# EAGLE board nixie_schema (EAGLE 8.2.1), part 1 of 2
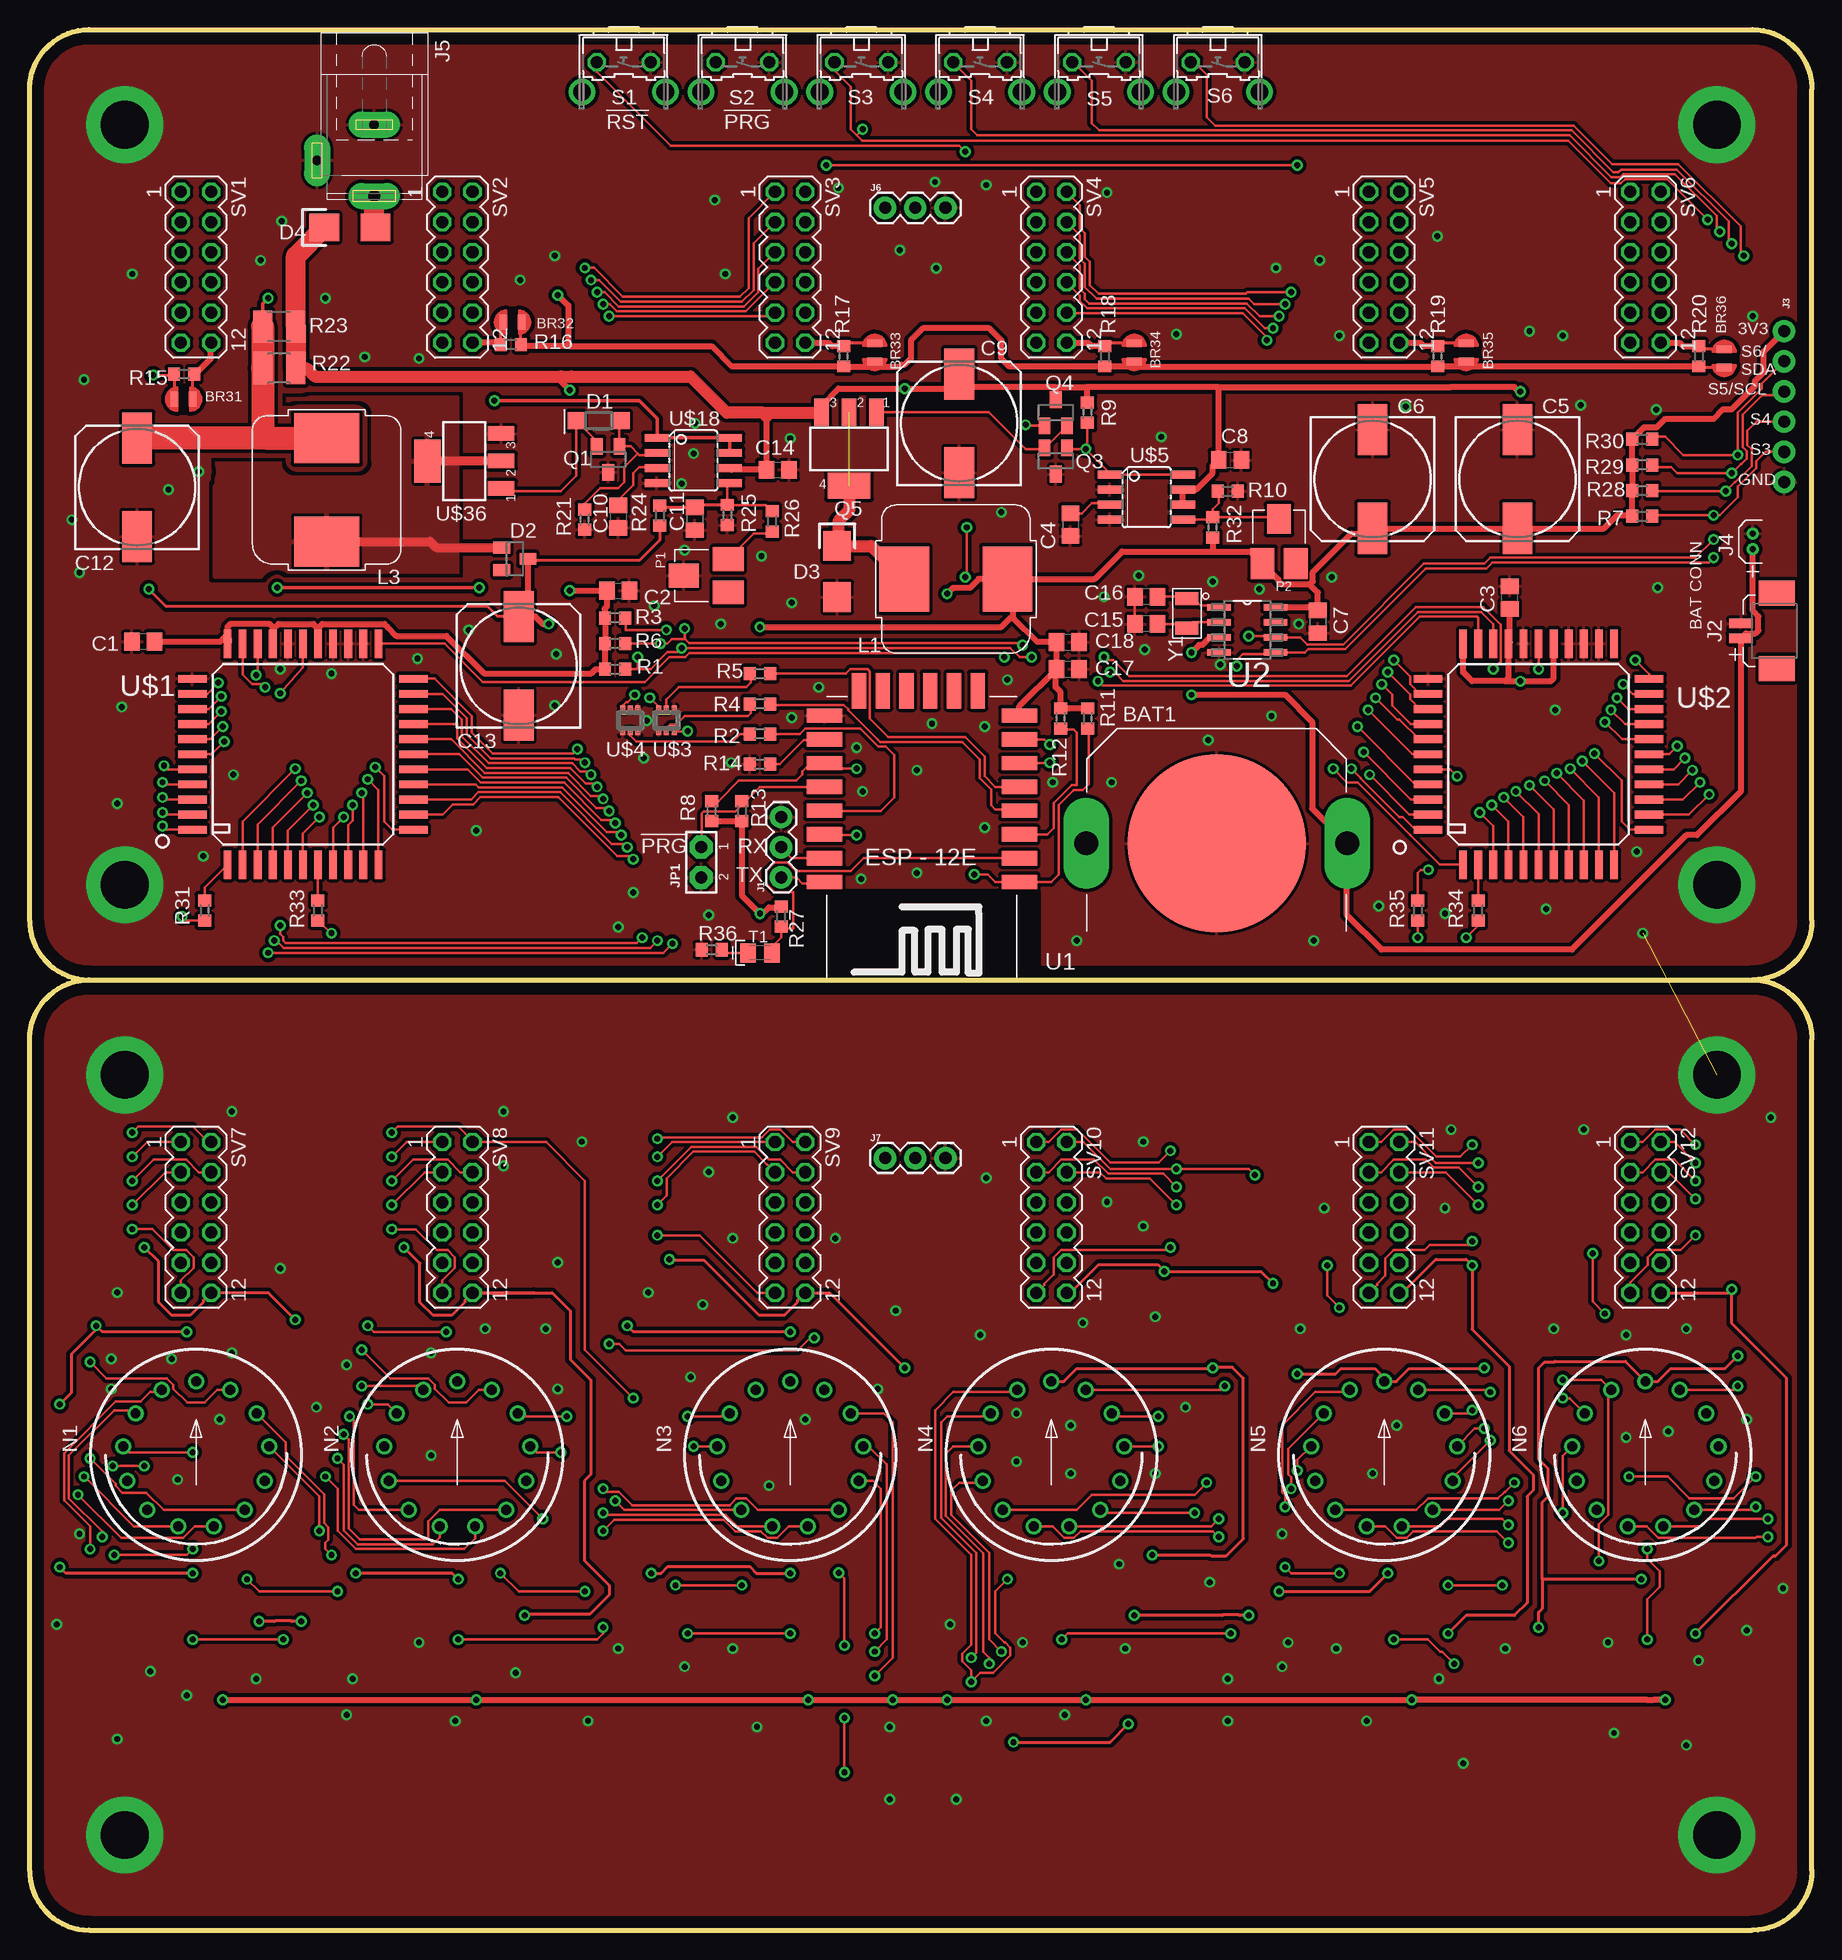
[diagram p6: board, top side]
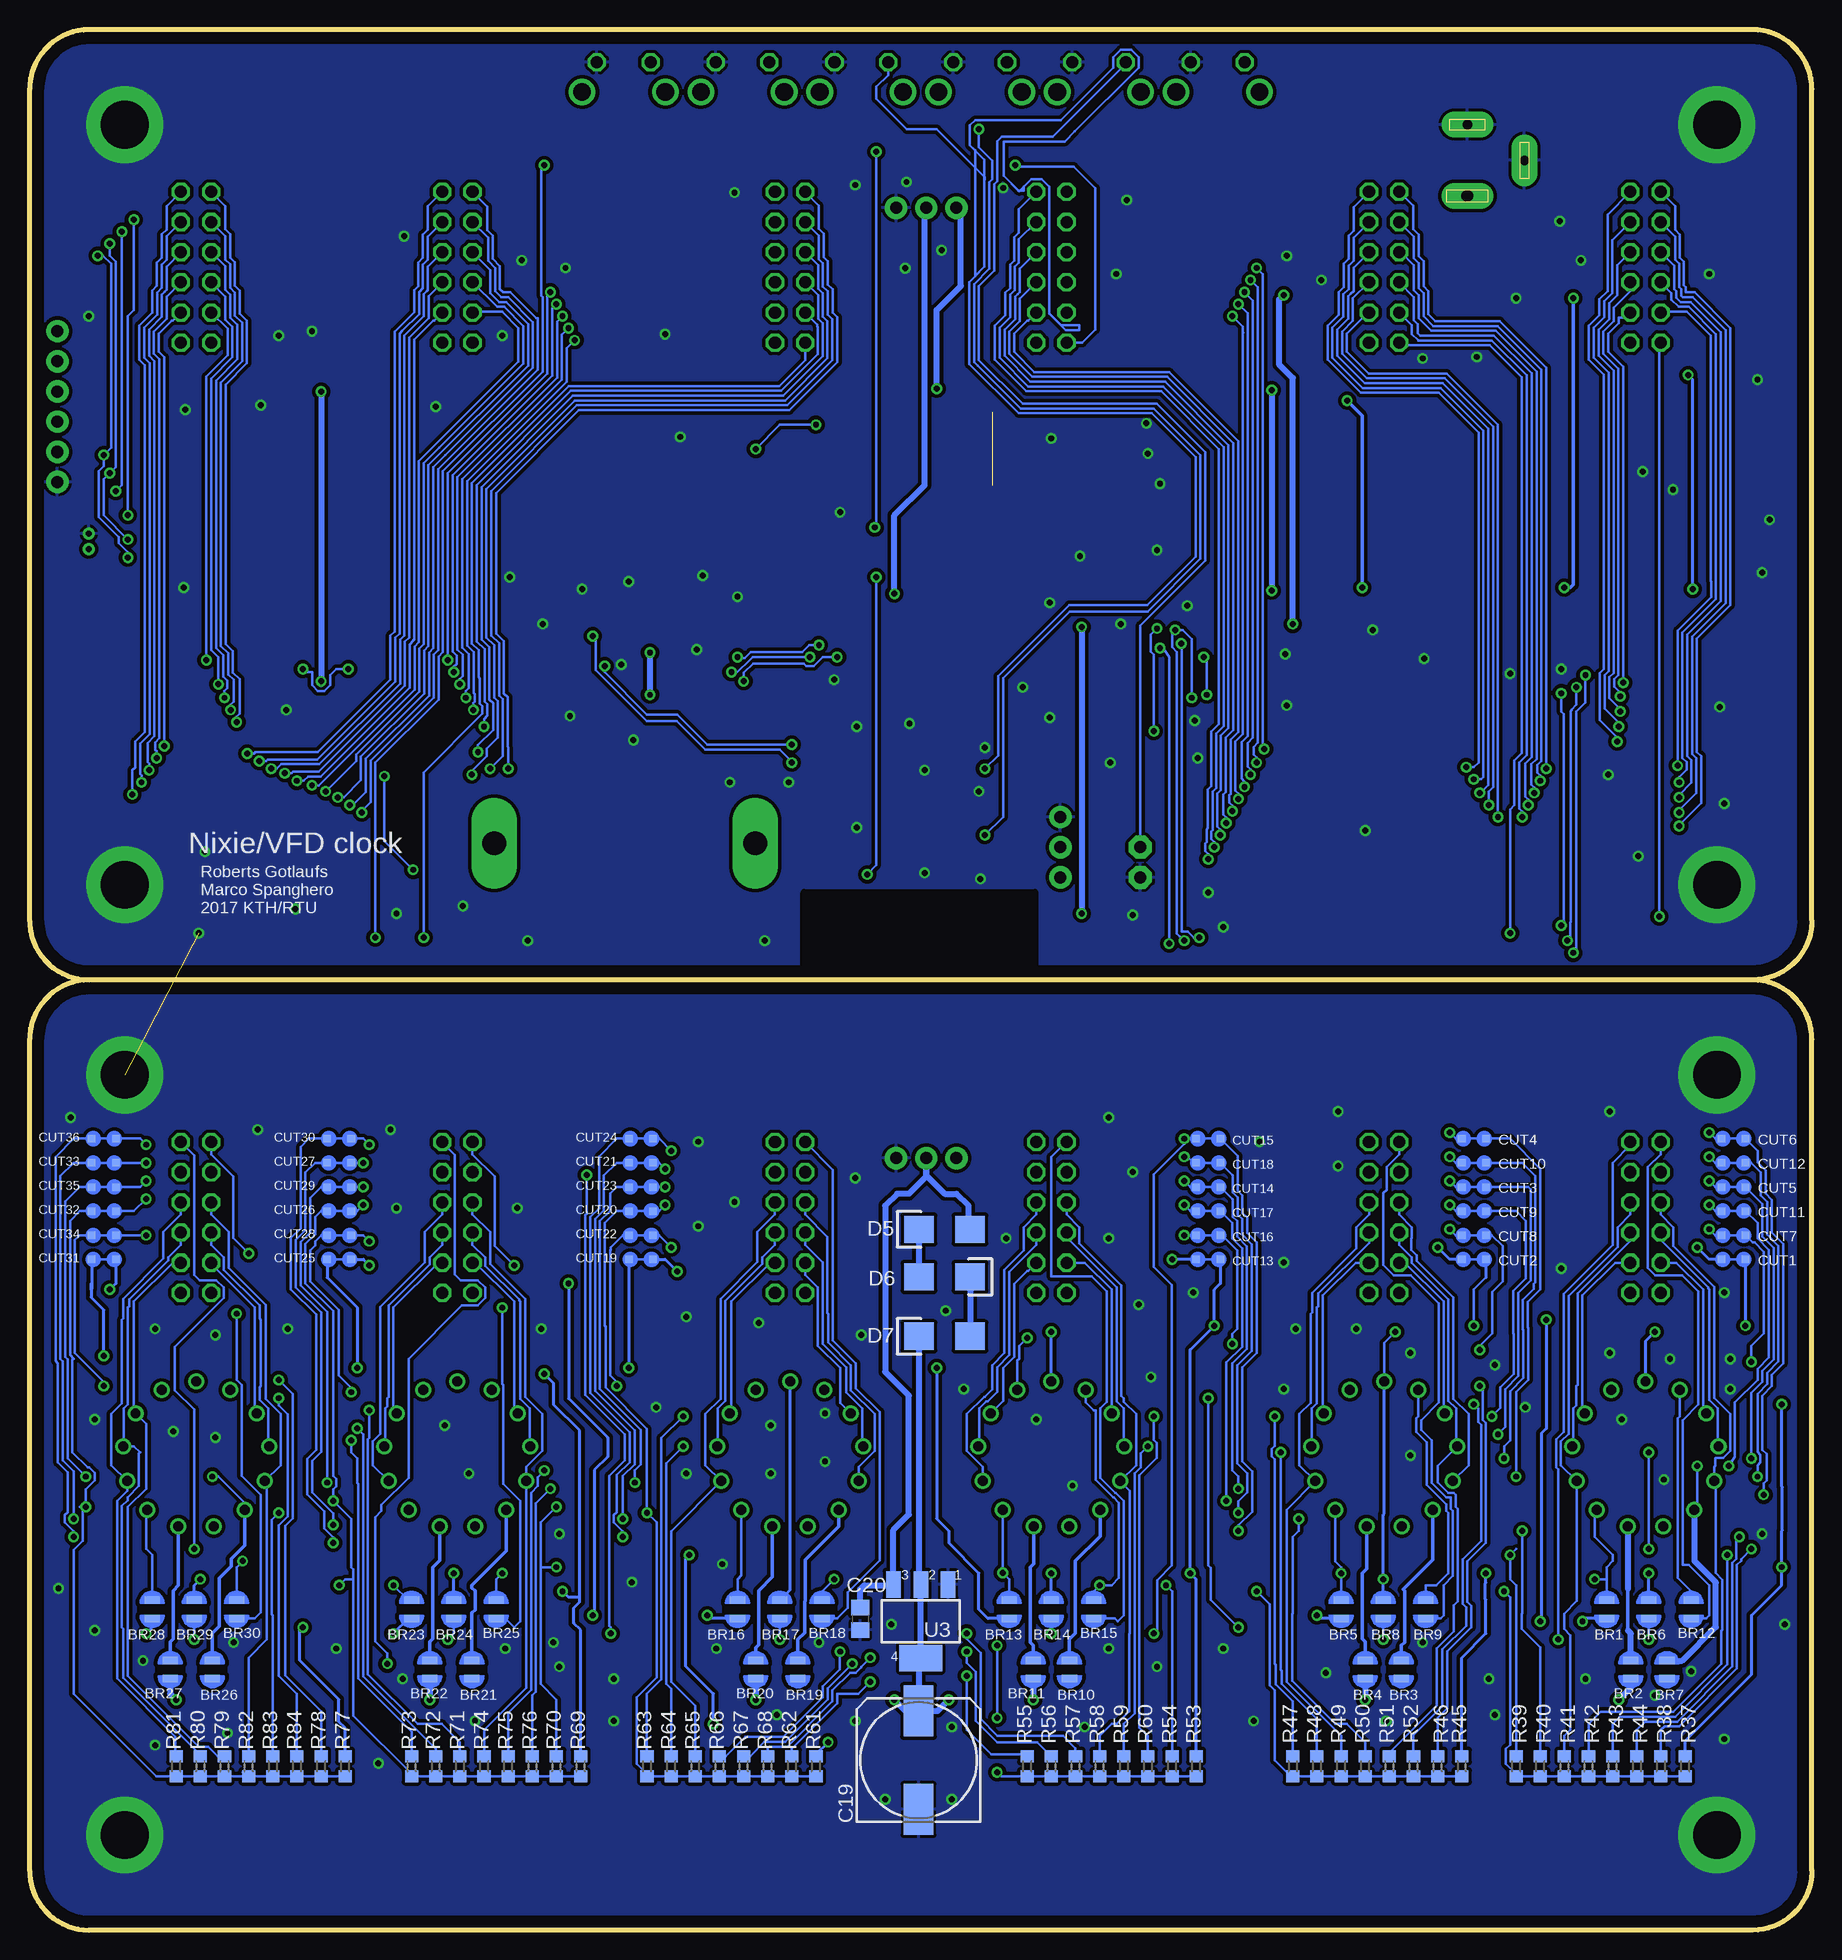
[diagram p7: board, bottom side, seen from below]

Size 150 x 160 mm. Coordinates in mm from the lower left corner, seen from the top.
Outline: 145,80 arc90 150,85 150,155 arc90 145,160 5,160 arc90 0,155 0,85 arc90 5,80
Outline: 5,80 145,80
Outline: 5,80 arc90 0,75 0,5 arc90 5,0 145,0 arc90 150,5 150,75 arc90 145,80
Copper layers (1*16): Top 0.035mm / dielectric 1.5mm / Bottom 0.035mm
Design rules "default *": minimum track width 8mil, minimum drill 16mil, track to track 8mil, track to pad 8mil, pad to pad 8mil, via to via 8mil, smd to smd 8mil, copper to edge 40mil, drill to drill 8mil, minimum pad ring 10mil, minimum via ring 8mil, stop-mask expansion 4mil, vias tented up to drill 0.5mm, thermal gap 10mil
Net classes: 0 default: width 0.203 mm, drill 0.5 mm, clearance 0.203 mm; 1 Power: width 0.508 mm, drill 0.5 mm, clearance 0.203 mm; 2 HV: width 0.254 mm, drill 0.5 mm, clearance 1 mm; 3 medium power: width 0.508 mm, drill 0.5 mm, clearance 0.203 mm; 4 smallish power: width 0.305 mm, drill 0.5 mm, clearance 0.203 mm
tRestrict: area 65.4,80.3 to 84.8,87.4
bRestrict: area 65.4,80.3 to 84.8,87.4

## Footprints (pad centres in the part's own frame; a part is rotated, then mirrored left to right if it is on the bottom)
CR2032 = drill 2 pad 3.81 long: +_1 10.985,0; +_2 -10.985,0 | smd 15 x 15: - 0,0
HV_SOLDER_BRIDGE = smd 1.27 x 0.635: P$1 0,0.762; P$2 0,-0.762
C0805 = smd 1.3 x 1.5: 1 -0.95,0; 2 0.95,0
153CLV-1014 = smd 4.3 x 2.5: + 4.15,0; - -4.15,0
CUT_TRACE_2 = smd 0.635 x 0.635: P$1 0,1.016; P$2 0,-1.016
SOD123 = smd 1.4 x 1.4: A 1.9,0; C -1.9,0
SOT23 = smd 1 x 1.4: 1 -0.95,-1.1; 2 0.95,-1.1; 3 0,1.1
SMA/SMB = smd 2.5 x 2.3: A 2.15,0; C -2.15,0
1X03 = drill 1.016 pad 1.88: 1 0,0; 2 2.54,0; 3 5.08,0
PICOBLADE_SMD_2 = smd 0.8 x 2: + -0.625,3; - 0.625,3 | smd 2.1 x 3: CHAS_1 -3.175,0; CHAS_2 3.175,0
1X06_NO_SILK = drill 1.016 pad 1.88: 1 0,0; 2 2.54,0; 3 5.08,0; 4 7.62,0; 5 10.16,0; 6 12.7,0
PICOBLADE_THT_2 = drill 0.5: + -0.625,0; - 0.675,0
SPC4077 = drill 0.8 pad 2.184 long: 1 -3,0; 2 0,-4.8 | drill 1 pad 2.184 long: 3 3,0
JUMPER2 = drill 1 pad 1.93 octagon: 1 2.54,0; 2 0,0
INDUCTOR_PACKAGE = smd 5.5 x 4.2: P$1 0,4.35; P$2 0,-4.35
IN-14_IV-11 = drill 0.84: 0(B) 5.094,3.516; 1(F) -5.094,3.516; 2(E) -6.145,0.746; 3(D) -5.788,-2.195; 4(CAT) -4.105,-4.633; 5(NC) -1.481,-6.01; 6(CAT) 1.481,-6.01; 7(GRID) 4.105,-4.633; 8(C) 5.788,-2.195; 9(DP) 6.145,0.746; A(A) 0,6.19; LHDP(G) -2.877,5.481; RHDP(NC) 2.877,5.481
UNI_POT_SMD = smd 2 x 2.6: P$1 -1.4,-1.9; P$3 1.4,-1.9 | smd 2 x 2.5: P$2 0,1.85
SOT223 = smd 1.219 x 2.235: 1 -2.311,-3.099; 2 0,-3.099; 3 2.311,-3.099 | smd 3.6 x 2.2: 4 0,3.099
R0603 = smd 1 x 1.1: 1 -0.85,0; 2 0.85,0
R1210 = smd 1.6 x 2.7: 1 -1.4,0; 2 1.4,0
B3F-31XX = drill 1.016 octagon: 1 -2.261,-1.245; 2 2.261,-1.245 | drill 1.499 pad 2.159: 3 -3.505,1.245; 4 3.505,1.245
MA06-2 = drill 1.016 octagon: 1 -6.35,-1.27; 2 -6.35,1.27; 3 -3.81,-1.27; 4 -3.81,1.27; 5 -1.27,-1.27; 6 -1.27,1.27; 7 1.27,-1.27; 8 1.27,1.27; 9 3.81,-1.27; 10 3.81,1.27; 11 6.35,-1.27; 12 6.35,1.27
C0805K = smd 1.3 x 1.6: COL 1,0; EMI -1,0
ESP12E-SMD = smd 3 x 1.2: ADC -8.3,3.8; CH_PD -8.3,1.8; GND 8.1,-8.2; GPIO0 8.1,-2.2; GPIO2 8.1,-4.2; GPIO4 8.1,-0.2; GPIO5 8.1,1.8; GPIO12 -8.3,-4.2; GPIO13 -8.3,-6.2; GPIO14 -8.3,-2.2; GPIO15 8.1,-6.2; GPIO16 -8.3,-0.2; RESET -8.3,5.8; RXD0 8.1,3.8; TXD0 8.1,5.8; VCC -8.3,-8.2 | smd 1.2 x 3: CS0 -4.8,-10.3; GPIO9 -0.8,-10.3; GPIO10 1.2,-10.3; MISO -2.8,-10.3; MOSI 3.2,-10.3; SCLK 5.2,-10.3
SOIC8-N_MC = smd 1.981 x 0.559: 1 -2.362,1.905; 2 -2.362,0.635; 3 -2.362,-0.635; 4 -2.362,-1.905; 5 2.362,-1.905; 6 2.362,-0.635; 7 2.362,0.635; 8 2.362,1.905
CQFP-44 = smd 0.65 x 2.4: 1 -6.35,-9.3; 2 -5.08,-9.3; 3 -3.81,-9.3; 4 -2.54,-9.3; 5 -1.27,-9.3; 6 0,-9.3; 7 1.27,-9.3; 8 2.54,-9.3; 9 3.81,-9.3; 10 5.08,-9.3; 11 6.35,-9.3; 23 6.35,9.3; 24 5.08,9.3; 25 3.81,9.3; 26 2.54,9.3; 27 1.27,9.3; 28 0,9.3; 29 -1.27,9.3; 30 -2.54,9.3; 31 -3.81,9.3; 32 -5.08,9.3; 33 -6.35,9.3 | smd 2.4 x 0.65: 12 9.3,-6.35; 13 9.3,-5.08; 14 9.3,-3.81; 15 9.3,-2.54; 16 9.3,-1.27; 17 9.3,0; 18 9.3,1.27; 19 9.3,2.54; 20 9.3,3.81; 21 9.3,5.08; 22 9.3,6.35; 34 -9.3,6.35; 35 -9.3,5.08; 36 -9.3,3.81; 37 -9.3,2.54; 38 -9.3,1.27; 39 -9.3,0; 40 -9.3,-1.27; 41 -9.3,-2.54; 42 -9.3,-3.81; 43 -9.3,-5.08; 44 -9.3,-6.35
SOT-363 = smd 0.42 x 0.6: 1 -0.65,-0.95; 2 0,-0.95; 3 0.65,-0.95; 4 0.65,0.95; 5 0,0.95; 6 -0.65,0.95
SOIC08 = smd 0.66 x 2.032: 1 -1.905,-3.073; 2 -0.635,-3.073; 3 0.635,-3.073; 4 1.905,-3.073; 5 1.905,3.073; 6 0.635,3.073; 7 -0.635,3.073; 8 -1.905,3.073
CRYSTAL_PACK = smd 1.1 x 1.9: P$1 -1.25,0; P$2 1.25,0

## Placement (x,y rotation side)
BAT1  CR2032  [CR2032]  99.91,91.5 0 top
BR1  HV_SOLDER_BRIDGE  [HV_SOLDER_BRIDGE]  17.27,27.01 0 bottom
BR2  HV_SOLDER_BRIDGE  [HV_SOLDER_BRIDGE]  15.24,21.93 180 bottom
BR3  HV_SOLDER_BRIDGE  [HV_SOLDER_BRIDGE]  34.54,21.93 0 bottom
BR4  HV_SOLDER_BRIDGE  [HV_SOLDER_BRIDGE]  37.59,21.93 180 bottom
BR5  HV_SOLDER_BRIDGE  [HV_SOLDER_BRIDGE]  39.62,27.01 0 bottom
BR6  HV_SOLDER_BRIDGE  [HV_SOLDER_BRIDGE]  13.72,27.01 0 bottom
BR7  HV_SOLDER_BRIDGE  [HV_SOLDER_BRIDGE]  12.19,21.93 0 bottom
BR8  HV_SOLDER_BRIDGE  [HV_SOLDER_BRIDGE]  36.07,27.01 0 bottom
BR9  HV_SOLDER_BRIDGE  [HV_SOLDER_BRIDGE]  32.51,27.01 180 bottom
BR10  HV_SOLDER_BRIDGE  [HV_SOLDER_BRIDGE]  62.48,21.93 0 bottom
BR11  HV_SOLDER_BRIDGE  [HV_SOLDER_BRIDGE]  65.53,21.93 180 bottom
BR12  HV_SOLDER_BRIDGE  [HV_SOLDER_BRIDGE]  10.16,27.01 180 bottom
BR13  HV_SOLDER_BRIDGE  [HV_SOLDER_BRIDGE]  67.56,27.01 0 bottom
BR14  HV_SOLDER_BRIDGE  [HV_SOLDER_BRIDGE]  64.01,27.01 0 bottom
BR15  HV_SOLDER_BRIDGE  [HV_SOLDER_BRIDGE]  60.45,27.01 180 bottom
BR16  HV_SOLDER_BRIDGE  [HV_SOLDER_BRIDGE]  90.42,27.01 0 bottom
BR17  HV_SOLDER_BRIDGE  [HV_SOLDER_BRIDGE]  86.87,27.01 0 bottom
BR18  HV_SOLDER_BRIDGE  [HV_SOLDER_BRIDGE]  83.31,27.01 180 bottom
BR19  HV_SOLDER_BRIDGE  [HV_SOLDER_BRIDGE]  85.34,21.93 0 bottom
BR20  HV_SOLDER_BRIDGE  [HV_SOLDER_BRIDGE]  88.9,21.93 180 bottom
BR21  HV_SOLDER_BRIDGE  [HV_SOLDER_BRIDGE]  112.78,21.93 0 bottom
BR22  HV_SOLDER_BRIDGE  [HV_SOLDER_BRIDGE]  116.33,21.93 180 bottom
BR23  HV_SOLDER_BRIDGE  [HV_SOLDER_BRIDGE]  117.86,27.01 0 bottom
BR24  HV_SOLDER_BRIDGE  [HV_SOLDER_BRIDGE]  114.3,27.01 0 bottom
BR25  HV_SOLDER_BRIDGE  [HV_SOLDER_BRIDGE]  110.74,27.01 180 bottom
BR26  HV_SOLDER_BRIDGE  [HV_SOLDER_BRIDGE]  134.62,21.93 0 bottom
BR27  HV_SOLDER_BRIDGE  [HV_SOLDER_BRIDGE]  138.18,21.93 180 bottom
BR28  HV_SOLDER_BRIDGE  [HV_SOLDER_BRIDGE]  139.7,27.01 0 bottom
BR29  HV_SOLDER_BRIDGE  [HV_SOLDER_BRIDGE]  136.14,27.01 0 bottom
BR30  HV_SOLDER_BRIDGE  [HV_SOLDER_BRIDGE]  132.59,27.01 180 bottom
BR31  HV_SOLDER_BRIDGE  [HV_SOLDER_BRIDGE]  12.95,128.9 270 top
BR32  HV_SOLDER_BRIDGE  [HV_SOLDER_BRIDGE]  40.64,135.37 90 top
BR33  HV_SOLDER_BRIDGE  [HV_SOLDER_BRIDGE]  71.12,132.83 0 top
BR34  HV_SOLDER_BRIDGE  [HV_SOLDER_BRIDGE]  92.96,132.83 0 top
BR35  HV_SOLDER_BRIDGE  [HV_SOLDER_BRIDGE]  120.9,132.83 0 top
BR36  HV_SOLDER_BRIDGE  [HV_SOLDER_BRIDGE]  142.62,132.32 0 top
C1  100n  [C0805]  9.54,108.47 180 top
C2  100n  [C0805]  49.53,112.77 0 top
C3  100n  [C0805]  124.58,112.2 90 top
C4  270p  [C0805]  87.6,118.32 270 top
C5  100u  [153CLV-1014]  125.22,122.16 270 top
C6  100u  [153CLV-1014]  113.03,122.16 270 top
C7  100n  [C0805]  108.42,110.15 270 top
C8  100n  [C0805]  101.03,123.78 0 top
C9  220u  [153CLV-1014]  78.23,126.86 90 top
C10  680p  [C0805]  49.54,119.02 270 top
C11  10n  [C0805]  55.98,118.82 270 top
C12  220u  [153CLV-1014]  9.04,121.48 90 top
C13  2.2u  [153CLV-1014]  41.16,106.44 90 top
C14  100n  [C0805]  62.96,122.94 0 top
C15  6p  [C0805]  93.98,109.97 180 top
C16  6p  [C0805]  93.98,112.26 180 top
C17  100n  [C0805]  87.38,106.16 0 top
C18  100n  [C0805]  87.38,108.45 0 top
C19  10u  [153CLV-1014]  75.18,14.31 90 bottom
C20  100n  [C0805]  80.1,26.22 270 bottom
CUT1  CUT_TRACE  [CUT_TRACE_2]  6.6,56.47 270 bottom
CUT2  CUT_TRACE  [CUT_TRACE_2]  28.45,56.47 270 bottom
CUT3  CUT_TRACE  [CUT_TRACE_2]  28.45,62.57 270 bottom
CUT4  CUT_TRACE  [CUT_TRACE_2]  28.45,66.63 270 bottom
CUT5  CUT_TRACE  [CUT_TRACE_2]  6.6,62.57 270 bottom
CUT6  CUT_TRACE  [CUT_TRACE_2]  6.6,66.63 270 bottom
CUT7  CUT_TRACE  [CUT_TRACE_2]  6.6,58.5 90 bottom
CUT8  CUT_TRACE  [CUT_TRACE_2]  28.45,58.5 90 bottom
CUT9  CUT_TRACE  [CUT_TRACE_2]  28.45,60.54 90 bottom
CUT10  CUT_TRACE  [CUT_TRACE_2]  28.45,64.6 90 bottom
CUT11  CUT_TRACE  [CUT_TRACE_2]  6.6,60.54 90 bottom
CUT12  CUT_TRACE  [CUT_TRACE_2]  6.6,64.6 90 bottom
CUT13  CUT_TRACE  [CUT_TRACE_2]  50.8,56.47 270 bottom
CUT14  CUT_TRACE  [CUT_TRACE_2]  50.8,62.57 270 bottom
CUT15  CUT_TRACE  [CUT_TRACE_2]  50.8,66.63 270 bottom
CUT16  CUT_TRACE  [CUT_TRACE_2]  50.8,58.5 90 bottom
CUT17  CUT_TRACE  [CUT_TRACE_2]  50.8,60.54 90 bottom
CUT18  CUT_TRACE  [CUT_TRACE_2]  50.8,64.6 90 bottom
CUT19  CUT_TRACE  [CUT_TRACE_2]  98.55,56.47 90 bottom
CUT20  CUT_TRACE  [CUT_TRACE_2]  98.55,60.54 90 bottom
CUT21  CUT_TRACE  [CUT_TRACE_2]  98.55,64.6 90 bottom
CUT22  CUT_TRACE  [CUT_TRACE_2]  98.55,58.5 270 bottom
CUT23  CUT_TRACE  [CUT_TRACE_2]  98.55,62.57 270 bottom
CUT24  CUT_TRACE  [CUT_TRACE_2]  98.55,66.63 270 bottom
CUT25  CUT_TRACE  [CUT_TRACE_2]  123.95,56.47 90 bottom
CUT26  CUT_TRACE  [CUT_TRACE_2]  123.95,60.54 90 bottom
CUT27  CUT_TRACE  [CUT_TRACE_2]  123.95,64.6 90 bottom
CUT28  CUT_TRACE  [CUT_TRACE_2]  123.95,58.5 270 bottom
CUT29  CUT_TRACE  [CUT_TRACE_2]  123.95,62.57 270 bottom
CUT30  CUT_TRACE  [CUT_TRACE_2]  123.95,66.63 270 bottom
CUT31  CUT_TRACE  [CUT_TRACE_2]  143.76,56.47 90 bottom
CUT32  CUT_TRACE  [CUT_TRACE_2]  143.76,60.54 90 bottom
CUT33  CUT_TRACE  [CUT_TRACE_2]  143.76,64.6 90 bottom
CUT34  CUT_TRACE  [CUT_TRACE_2]  143.76,58.5 270 bottom
CUT35  CUT_TRACE  [CUT_TRACE_2]  143.76,62.57 270 bottom
CUT36  CUT_TRACE  [CUT_TRACE_2]  143.76,66.63 270 bottom
D1  1n4148  [SOD123]  47.9,127.09 0 top
D2  BAS21  [SOT23]  40.83,115.45 270 top
D3  B230A-13-F  [SMA/SMB]  67.96,114.38 270 top
D4  B230A-13-F  [SMA/SMB]  26.95,143.35 0 top
D5  [SMA/SMB]  73,59 0 bottom
D6  [SMA/SMB]  73,55 180 bottom
D7  [SMA/SMB]  73,50 0 bottom
J1  [1X03]  63.25,88.64 90 top
J2  RTC_CONSMD  [PICOBLADE_SMD_2]  147.05,109.39 90 top
J3  [1X06_NO_SILK]  147.67,134.62 270 top
J4  RTC_CONTHT  [PICOBLADE_THT_2]  145.04,116.89 90 top
J5  [SPC4077]  29,149 270 top
J6  [1X03]  72,145 0 top
J7  [1X03]  72,65 0 top
JP1  [JUMPER2]  56.52,88.64 90 top
L1  100u  [INDUCTOR_PACKAGE]  77.95,113.75 90 top
L3  150u  [INDUCTOR_PACKAGE]  25,121.26 0 top
N1  IN-14_IV-11_COMBI  [IN-14_IV-11]  14,40 0 top
N2  IN-14_IV-11_COMBI  [IN-14_IV-11]  36,40 0 top
N3  IN-14_IV-11_COMBI  [IN-14_IV-11]  64,40 0 top
N4  IN-14_IV-11_COMBI  [IN-14_IV-11]  86,40 0 top
N5  IN-14_IV-11_COMBI  [IN-14_IV-11]  114,40 0 top
N6  IN-14_IV-11_COMBI  [IN-14_IV-11]  136,40 0 top
P1  100k  [UNI_POT_SMD]  56.9,114.04 90 top
P2  100k  [UNI_POT_SMD]  105.16,116.96 0 top
Q1  BC856B  [SOT23]  48.69,123.83 180 top
Q3  BC856B  [SOT23]  86.36,123.69 180 top
Q4  BCX70H  [SOT23]  86.36,127.75 0 top
Q5  NTF5P03  [SOT223]  68.96,124.7 180 top
R1  2.2k  [R0603]  49.28,106.16 0 top
R2  2.2k  [R0603]  61.47,100.7 180 top
R3  2.2k  [R0603]  49.28,110.48 0 top
R4  2.2k  [R0603]  61.47,103.24 180 top
R5  2.2k  [R0603]  61.47,105.78 180 top
R6  2.2k  [R0603]  49.28,108.32 0 top
R7  2.2K  [R0603]  135.72,119.04 180 top
R8  10k  [R0603]  57.4,94.22 90 top
R9  1k  [R0603]  89.03,127.75 270 top
R10  3.3k  [R0603]  100.84,121.15 0 top
R11  10k  [R0603]  89.05,102.01 90 top
R12  10k  [R0603]  86.77,102.01 90 top
R13  10k  [R0603]  59.94,94.22 90 top
R14  10k  [R0603]  61.47,98.16 0 top
R15  10k  [R0603]  13,131 180 top
R16  10k  [R0603]  40.5,133.5 0 top
R17  10k  [R0603]  68.5,132.5 270 top
R18  10k  [R0603]  90.5,132.5 270 top
R19  10k  [R0603]  118.5,132.5 270 top
R20  10k  [R0603]  140.5,132.5 270 top
R21  1k  [R0603]  46.71,118.75 270 top
R22  0.5R  [R1210]  21,131.5 180 top
R23  0.5R  [R1210]  21,135 180 top
R24  330k  [R0603]  53.05,119.09 90 top
R25  3.3k  [R0603]  58.71,119.14 270 top
R26  5.6k  [R0603]  62.48,118.61 270 top
R27  [R0603]  63.25,85.33 270 top
R28  2.2K  [R0603]  135.72,121.19 180 top
R29  2.2K  [R0603]  135.72,123.35 180 top
R30  2.2K  [R0603]  135.72,125.51 180 top
R31  68k  [R0603]  14.73,85.84 90 top
R32  5.6k  [R0603]  99.57,118.1 90 top
R33  68k  [R0603]  24.26,85.84 90 top
R34  68k  [R0603]  121.92,85.84 90 top
R35  68k  [R0603]  116.84,85.84 90 top
R36  [R0603]  57.4,82.54 180 top
R37  8.2k  [R0603]  10.67,13.8 270 bottom
R38  8.2k  [R0603]  12.7,13.8 270 bottom
R39  8.2k  [R0603]  24.89,13.8 270 bottom
R40  8.2k  [R0603]  22.86,13.8 270 bottom
R41  8.2k  [R0603]  20.83,13.8 270 bottom
R42  8.2k  [R0603]  18.8,13.8 270 bottom
R43  8.2k  [R0603]  16.76,13.8 270 bottom
R44  8.2k  [R0603]  14.73,13.8 270 bottom
R45  8.2k  [R0603]  29.46,13.8 270 bottom
R46  8.2k  [R0603]  31.5,13.8 270 bottom
R47  8.2k  [R0603]  43.69,13.8 270 bottom
R48  8.2k  [R0603]  41.66,13.8 270 bottom
R49  8.2k  [R0603]  39.62,13.8 270 bottom
R50  8.2k  [R0603]  37.59,13.8 270 bottom
R51  8.2k  [R0603]  35.56,13.8 270 bottom
R52  8.2k  [R0603]  33.53,13.8 270 bottom
R53  8.2k  [R0603]  51.82,13.8 270 bottom
R54  8.2k  [R0603]  53.85,13.8 270 bottom
R55  8.2k  [R0603]  66.04,13.8 270 bottom
R56  8.2k  [R0603]  64.01,13.8 270 bottom
R57  8.2k  [R0603]  61.98,13.8 270 bottom
R58  8.2k  [R0603]  59.94,13.8 270 bottom
R59  8.2k  [R0603]  57.91,13.8 270 bottom
R60  8.2k  [R0603]  55.88,13.8 270 bottom
R61  8.2k  [R0603]  83.82,13.8 270 bottom
R62  8.2k  [R0603]  85.85,13.8 270 bottom
R63  8.2k  [R0603]  98.04,13.8 270 bottom
R64  8.2k  [R0603]  96.01,13.8 270 bottom
R65  8.2k  [R0603]  93.98,13.8 270 bottom
R66  8.2k  [R0603]  91.95,13.8 270 bottom
R67  8.2k  [R0603]  89.92,13.8 270 bottom
R68  8.2k  [R0603]  87.88,13.8 270 bottom
R69  8.2k  [R0603]  103.63,13.8 270 bottom
R70  8.2k  [R0603]  105.66,13.8 270 bottom
R71  8.2k  [R0603]  113.79,13.8 270 bottom
R72  8.2k  [R0603]  115.82,13.8 270 bottom
R73  8.2k  [R0603]  117.86,13.8 270 bottom
R74  8.2k  [R0603]  111.76,13.8 270 bottom
R75  8.2k  [R0603]  109.73,13.8 270 bottom
R76  8.2k  [R0603]  107.7,13.8 270 bottom
R77  8.2k  [R0603]  123.44,13.8 270 bottom
R78  8.2k  [R0603]  125.48,13.8 270 bottom
R79  8.2k  [R0603]  133.6,13.8 270 bottom
R80  8.2k  [R0603]  135.64,13.8 270 bottom
R81  8.2k  [R0603]  137.67,13.8 270 bottom
R82  8.2k  [R0603]  131.57,13.8 270 bottom
R83  8.2k  [R0603]  129.54,13.8 270 bottom
R84  8.2k  [R0603]  127.51,13.8 270 bottom
S1  [B3F-31XX]  50,156 180 top
S2  [B3F-31XX]  60,156 180 top
S3  [B3F-31XX]  70,156 180 top
S4  [B3F-31XX]  80,156 180 top
S5  [B3F-31XX]  90,156 180 top
S6  [B3F-31XX]  100,156 180 top
SV1  [MA06-2]  14,140 270 top
SV2  [MA06-2]  36,140 270 top
SV3  [MA06-2]  64,140 270 top
SV4  [MA06-2]  86,140 270 top
SV5  [MA06-2]  114,140 270 top
SV6  [MA06-2]  136,140 270 top
SV7  [MA06-2]  14,60 270 top
SV8  [MA06-2]  36,60 270 top
SV9  [MA06-2]  64,60 270 top
SV10  [MA06-2]  86,60 270 top
SV11  [MA06-2]  114,60 270 top
SV12  [MA06-2]  136,60 270 top
T1  [C0805K]  61.47,82.29 0 top
U1  [ESP12E-SMD]  75,94.05 180 top
U2  MC7940N  [SOIC8-N_MC]  102.48,109.47 0 top
U3  1V5  [SOT223]  75,26 180 bottom
U$1  HV5522  [CQFP-44]  23,99 0 top
U$2  HV5522  [CQFP-44]  127,99 0 top
U$3  BSS138DW  [SOT-363]  53.59,101.84 0 top
U$4  BSS138DW  [SOT-363]  50.55,101.84 0 top
U$5  MC34063  [SOIC08]  93.99,120.65 270 top
U$18  MC34063  [SOIC08]  55.85,123.73 270 top
U$36  IPN60R3K4CE_NMOS  [SOT223]  36.58,123.69 90 top
Y1  [CRYSTAL_PACK]  97.39,110.86 90 top

## Tracks (layer width: path | path; a pad name or v marks a point on that pad's centre or on a via)
1_0_B  (via drill 0.5)
  Top 0.203: N1.0(B) 21.55,41.06 21.55,39.92 24.79,36.67 24.79,34.28 25.14,33.93 25.14,32.85 24.89,32.6 24.89,32.09 v25.4,31.58
  Bottom 0.203: SV7.10 16.54,56.19 19.3,53.42 19.3,43.73 N1.0(B) | R39.1 24.89,29.04 25.4,29.55 v25.4,31.58 24.89,32.09
1_1_F  (via drill 0.5)
  Top 0.203: v6.1,33.1 6.1,33.56 3.31,36.35 3.31,39.97 7.11,43.77 8.65,43.77 N1.1(F)
  Bottom 0.203: SV7.9 11.4,56.19 9.14,53.93 9.14,43.76 N1.1(F) | R44.1 14.73,16.85 14.02,17.56 11.35,17.56 6.71,22.2 6.71,30.91 6.35,31.27 6.35,32.85 v6.1,33.1
1_2_E  (via drill 0.5)
  Top 0.203: v7.11,31.58 13.04,31.58 13.07,31.61 13.24,31.61 v13.72,32.09 | v13.72,40.22 8.38,40.22 N1.2(E)
  Bottom 0.203: SV7.7 12.73,58.09 8.74,54.1 8.74,54.03 8.64,53.93 8.64,44.63 7.93,43.92 7.93,40.82 N1.2(E) | R43.1 16.76,17.36 16.15,17.97 11.52,17.97 7.11,22.37 v7.11,31.58 | v13.72,32.09 v13.72,40.22
1_3_D
  Bottom 0.203: SV7.5 12.73,60.24 11.66,59.17 11.66,57.6 8.23,54.17 8.23,44.8 6.88,43.45 6.88,40.34 7.45,39.77 8.07,39.77 8.13,39.71 8.13,39.09 8.21,39.01 N1.3(D) 8.1,37.69 8.1,30.08 7.52,29.5 7.52,25.3 7.62,25.2 7.62,22.44 11.68,18.37 17.78,18.37 18.8,17.36 R42.1
1_4_CAT  (via drill 0.5)
  Top 0.203: v6.99,39.07 v9.65,39.07
  Bottom 0.203: CUT11.P$2 4.57,59.52 4.57,58.22 3.63,57.28 3.63,48.22 4.57,47.27 4.57,46.31 6.47,44.41 6.47,39.84 v6.99,39.07 | v9.65,39.07 9.65,35.48 N1.4(CAT)
  Bottom 0.508: N1.4(CAT) 9.89,31.09 8.08,29.27 8.08,25.53 10.92,22.69 BR7.P$1
1_5_NC  (via drill 0.5)
  Top 0.203: N1.5(NC) 8.77,33.99 v4.57,38.18
  Bottom 0.203: v4.57,38.18 4.57,39.14 4.32,39.39 4.32,40.02 4.57,40.27 4.57,45.16 3.76,45.98 3.76,46.94 2.81,47.88 2.81,57.61 3.76,58.56 3.76,61.31 4.29,61.84 4.29,63.8 5.08,64.6 CUT12.P$2
1_6_CAT  (via drill 0.5)
  Top 0.203: N1.6(CAT) 13.9,33.99 12.92,33.01 7.71,33.01 v4.06,36.66
  Bottom 0.203: v4.06,36.66 4.06,37.62 3.81,37.87 3.81,40.09 4.17,40.44 4.17,44.99 3.35,45.81 3.35,46.77 2.41,47.71 2.41,57.78 3.35,58.73 3.35,61.48 3.88,62.01 3.88,63.97 4.54,64.63 4.54,65.58 CUT6.P$1
  Bottom 0.279: 15.48,28.77 15.48,28.57 15.49,28.56 15.49,25.23
  Bottom 0.508: N1.6(CAT) 15.48,28.77 15.46,28.75 | BR2.P$2 15.24,24.98 15.49,25.23
1_7_GRID  (via drill 0.5)
  Top 0.203: v5.08,39.71 7.23,37.55 7.23,37.4 7.81,36.83 9.82,36.83 11.28,35.37 N1.7(GRID) | v25.91,28.53 19.3,28.53 v18.29,29.55
  Bottom 0.203: v5.08,39.71 5.08,45.23 4.17,46.14 4.17,47.1 3.22,48.05 3.22,57.45 4.17,58.39 4.17,61.15 CUT5.P$1 | N1.7(GRID) 18.29,35.18 18.29,33.1 16.76,31.58 16.76,31.07 17.27,30.56 17.27,29.55 | 17.27,29.55 BR1.P$1 | R37.2 R38.2 R44.2 R43.2 R42.2 R41.2 R40.2 R39.2 24.89,13.17 25.75,14.02 25.75,15.28 25.4,15.62 25.4,28.02 v25.91,28.53 | v18.29,29.55 17.27,29.55
1_8_C
  Bottom 0.203: SV7.6 15.27,60.24 16.34,59.17 16.34,57.54 20.48,53.4 20.48,41.8 21.12,41.15 21.12,39.14 N1.8(C) 19.79,27.71 20.86,26.64 20.86,25.35 20.32,24.81 20.32,16.85 20.83,16.34 R41.1
1_9_DP  (via drill 0.5)
  Top 0.203: v24.38,33.61 24.38,36.51 N1.9(DP)
  Bottom 0.203: SV7.8 15.27,58.03 19.71,53.59 19.71,45.91 19.81,45.8 19.81,44.18 20.07,43.92 20.07,40.82 N1.9(DP) | R40.1 22.86,23.79 24.41,25.35 24.41,26.64 24.38,26.67 v24.38,33.61
1_A_A  (via drill 0.5)
  Top 0.254: v13.21,50.38 6.1,50.38 v5.59,50.88 5.59,50.58 3.5,48.49 3.5,45.24 v2.54,44.28 | v13.72,30.06 3.05,30.06 v2.54,30.56
  Bottom 0.254: N1.A(A) 14,49.58 v13.21,50.38 | CUT1.P$1 v5.59,50.88 | v2.54,44.28 2.54,37.37 2.48,37.31 2.48,33.67 2.54,33.61 v2.54,30.56 2.54,29.04 5.07,26.51 5.07,21.52 10.67,15.93 R37.1 | BR6.P$1 v13.72,30.06
1_LDP_G  (via drill 0.5)
  Top 0.203: v5.08,32.09 5.08,34 2.9,36.18 2.9,40.13 7.26,44.49 9.36,44.49 10.16,45.3 10.94,45.3 N1.LHDP(G)
  Bottom 0.203: N1.LHDP(G) 11.12,43.26 11.28,43.1 11.28,29.65 10.16,28.53 BR12.P$2 | R38.1 12.7,16.85 12.39,17.15 11.18,17.15 6.3,22.03 6.3,30.75 5.95,31.1 5.95,31.22 v5.08,32.09
1_RDP_NC  (via drill 0.5)
  Top 0.203: N1.RHDP(NC) 15.8,45.48 14.73,44.41 13.27,44.41 12.1,45.58 12.1,45.89 11.53,46.46 6.46,46.46 v5.08,47.84
  Bottom 0.203: v5.08,47.84 5.08,49.19 4.03,50.24 4.03,57.11 4.81,57.89 4.97,57.89 4.99,57.9 CUT7.P$2
1V5  (via drill 0.5)
  Top 0.508: v16.26,19.39 v37.59,19.39 v65.53,19.39 v72.64,19.39 v77.22,19.39 v88.9,19.39 v116.33,19.39 136.14,19.39 136.65,19.39 v137.67,19.39
  Bottom 0.508: 75,28.53 U3.4 75.18,22.72 C19.+ | 75,28.53 U3.2 | D7.C 75.15,28.68 75,28.53 | C19.+ 73.57,18.46 v72.64,19.39 | C19.+ 76.29,18.46 v77.22,19.39 | BR2.P$1 15.24,20.4 v16.26,19.39 | BR4.P$1 v37.59,19.39 | BR11.P$1 v65.53,19.39 | BR20.P$1 v88.9,19.39 | BR22.P$1 v116.33,19.39 | BR27.P$1 138.18,19.9 v137.67,19.39
2_0_B  (via drill 0.5)
  Top 0.203: v45.21,43.26 41.35,43.26 N2.0(B)
  Bottom 0.203: SV8.10 38.38,56.19 41.15,53.42 41.15,43.57 N2.0(B) | R47.1 43.69,19.26 45.11,20.68 45.11,22.33 45.21,22.44 45.21,39.65 45.46,39.9 45.46,40.53 45.21,40.78 v45.21,43.26
2_1_F  (via drill 0.5)
  Top 0.203: v28.45,44.28 30.14,44.28 N2.1(F)
  Bottom 0.203: SV8.9 34.26,56.19 30.99,52.92 30.99,43.6 N2.1(F) | R52.1 33.53,16.41 31.1,18.84 31.1,23.62 29.1,25.62 29.1,27.17 29.39,27.47 29.39,31.21 27.84,32.76 27.84,42.53 28.09,42.78 28.09,43.92 v28.45,44.28
2_2_E
  Bottom 0.203: SV8.7 34.73,57.7 33.66,56.63 33.66,56.17 30.58,53.08 30.58,44.58 29.93,43.92 29.93,40.82 N2.2(E) 31.5,39.1 31.5,37.7 30.62,36.83 30.14,36.83 29.97,36.66 29.97,35.64 29.8,35.47 29.8,27.69 30.14,27.34 30.14,25.15 31.56,23.73 31.56,18.95 35.56,14.95 R51.1
2_3_D  (via drill 0.5)
  Top 0.203: N2.3(D) 40,37.8 v43.18,34.63
  Bottom 0.203: SV8.5 34.73,60.24 33.66,59.17 33.66,58.29 33.74,58.22 33.74,57.28 33.26,56.8 33.26,56.33 30.18,53.25 30.18,44.74 28.88,43.45 28.88,39.14 N2.3(D) | v43.18,34.63 43.18,33.61 43.69,33.1 43.69,26.67 43.72,26.64 43.72,21.01 40.1,17.39 39.15,17.39 37.59,15.83 R50.1
2_4_CAT  (via drill 0.5)
  Top 0.203: N2.4(CAT) 27.71,35.37 27.26,35.81 27.26,42.93 v26.92,43.26
  Bottom 0.203: v26.92,43.26 26.21,43.98 26.21,45.7 25.09,46.82 25.09,50.21 25.13,50.24 25.13,53.83 24.08,54.88 24.08,59.72 24.89,60.54 CUT9.P$2
  Bottom 0.305: N2.4(CAT) 31.89,31.18 34.4,28.68 34.28,28.56 34.28,24.22 34.54,23.96 BR3.P$1
2_5_NC  (via drill 0.5)
  Top 0.203: N2.5(NC) 34.52,33.08 33.93,32.49 27.6,32.49 26.45,33.65 26.45,39.17 v25.91,39.71
  Bottom 0.203: v25.91,39.71 25.91,40.72 25.4,41.23 25.4,45.36 24.28,46.48 24.28,50.55 24.31,50.58 24.31,53.05 23.4,53.97 23.4,54.41 23.27,54.54 23.27,63.48 24.38,64.6 CUT10.P$2
2_6_CAT  (via drill 0.5)
  Top 0.203: N2.6(CAT) 37.48,32.99 36.58,32.09 27.43,32.09 25.91,33.61 25.91,37.17 v24.89,38.18
  Bottom 0.203: v24.89,38.18 24.89,45.3 23.88,46.31 23.88,50.72 23.91,50.75 23.91,52.89 22.86,53.93 22.86,64.09 25.4,66.63 CUT4.P$1
  Bottom 0.305: N2.6(CAT) 37.48,30.41 37.85,30.03 37.85,24.52 37.59,24.26 BR4.P$2
2_7_GRID  (via drill 0.5)
  Top 0.203: N2.7(GRID) 34.51,35.37 33.54,34.4 33.54,33.12 33.33,32.9 27.77,32.9 26.86,33.81 26.86,41.3 v26.42,41.74 | v46.74,28.53 41.15,28.53 v39.62,30.06
  Bottom 0.203: N2.7(GRID) 40.1,31.05 39.62,30.56 v39.62,30.06 BR5.P$1 | v26.42,41.74 25.81,42.35 25.81,45.53 24.69,46.65 24.69,50.38 24.72,50.41 24.72,53.66 23.67,54.71 23.67,62.36 23.88,62.57 CUT3.P$1 | R45.2 R46.2 R52.2 R51.2 R50.2 R49.2 R48.2 R47.2 43.85,12.95 45.21,14.31 45.21,20.2 45.62,20.61 45.62,27.41 v46.74,28.53
2_8_C
  Bottom 0.203: SV8.6 37.27,60.24 38.34,59.17 38.34,57.39 42.06,53.66 42.06,52 42.16,51.9 42.16,44.41 43.12,43.45 43.12,39.14 N2.8(C) 44.2,35.4 44.2,20.91 39.62,16.34 R49.1
2_9_DP  (via drill 0.5)
  Top 0.203: v44.7,40.22 42.67,40.22 N2.9(DP)
  Bottom 0.203: SV8.8 37.27,57.88 41.55,53.59 41.55,52.51 41.66,52.41 41.66,44.34 42.07,43.92 42.07,40.82 N2.9(DP) | R48.1 41.66,17.8 44.6,20.74 44.6,21.83 44.7,21.93 v44.7,40.22
2_A_A  (via drill 0.5)
  Top 0.203: v35.05,50.38 28.96,50.38 v28.45,50.88
  Top 0.254: v27.43,30.06 35.56,30.06 v36.07,29.55
  Bottom 0.203: N2.A(A) 36,49.43 v35.05,50.38 | v28.45,50.88 28.45,53.93 27.43,54.95
  Bottom 0.254: CUT2.P$1 27.43,54.95 | R45.1 29.46,22.94 27.43,24.98 27.43,27.82 27.49,27.88 27.49,29.19 27.43,29.24 v27.43,30.06 | BR8.P$1 v36.07,29.55 36.07,34.99 36,35.06 N2.A(A)
2_LDP_G  (via drill 0.5)
  Top 0.203: 32.94,45.3 N2.LHDP(G) 32.8,45.8 v27.94,45.8
  Bottom 0.203: N2.LHDP(G) 33.12,43.26 33.28,43.1 33.28,41.93 32.41,41.06 32.41,37.47 30.79,35.84 30.79,35.31 30.61,35.13 30.61,30.06 31.63,29.04 32.51,29.04 BR9.P$2 | R46.1 31.5,17.86 30.69,18.67 30.69,23.45 28.66,25.48 28.66,27.31 28.99,27.64 28.99,31.04 27.43,32.6 27.43,42.7 27.68,42.95 27.68,45.55 v27.94,45.8
2_RDP_NC  (via drill 0.5)
  Top 0.203: N2.RHDP(NC) 37.8,45.48 36.73,44.41 35.27,44.41 34.1,45.58 34.1,45.89 33.53,46.46 30.33,46.46 v27.94,48.85
  Bottom 0.203: v27.94,48.85 27.94,49.19 26.89,50.24 26.89,53.75 26.01,54.63 26.01,57.59 26.92,58.5 CUT8.P$2
3_0_B  (via drill 0.5)
  Top 0.203: N3.0(B) 71.88,43.52 72.64,42.76 72.64,22.94 v71.12,21.42
  Bottom 0.203: SV9.10 65.95,55.51 66.04,55.51 67.13,54.42 67.13,48.27 68.07,47.33 68.07,44.54 N3.0(B) | v71.12,21.42 71.12,16.85 69.09,14.82 66.21,14.82 R55.1
3_1_F  (via drill 0.5)
  Top 0.203: v55.37,43.26 58.65,43.26 N3.1(F)
  Bottom 0.203: SV9.9 61.19,56.19 58.93,53.93 58.93,43.54 N3.1(F) | v55.37,43.26 55.37,41.29 55.12,41.04 55.12,39.75 56.59,38.28 56.59,25.48 56.59,25.18 56.59,17.05 55.88,16.34 R60.1
3_2_E  (via drill 0.5)
  Top 0.203: v55.88,40.72 57.83,40.72 N3.2(E)
  Bottom 0.203: SV9.7 62.73,58.31 58.52,54.1 58.52,44.52 57.93,43.92 57.93,40.82 N3.2(E) | v55.88,40.72 56.47,40.13 56.47,38.97 57,38.45 57,24.98 57,24.81 57,18.27 57.91,17.36 R59.1
3_3_D
  Bottom 0.203: SV9.5 62.73,60.24 61.66,59.17 61.66,57.82 58.12,54.27 58.12,44.99 57.91,44.79 57.91,44.48 56.88,43.45 56.88,39.14 N3.3(D) 57.4,37 57.4,24.98 57.44,24.94 57.44,18.41 58.49,17.36 58.93,17.36 59.94,16.34 R58.1
3_4_CAT  (via drill 0.5)
  Top 0.203: N3.4(CAT) 50.06,35.37 v49.28,36.15
  Bottom 0.203: v49.28,36.15 49.28,47.78 47.96,49.1 47.96,57.41 48.77,58.22 48.77,59.52 CUT17.P$2
  Bottom 0.305: N3.4(CAT) 59.9,33.15 61.98,31.07 61.98,24.98 62.48,24.47 BR10.P$1
3_5_NC  (via drill 0.5)
  Top 0.203: N3.5(NC) 59.57,33.99 58.6,34.96 48.44,34.96 v48.26,35.14
  Bottom 0.203: v48.26,35.14 48.26,36.1 47.5,36.85 47.5,38.44 48.36,39.3 48.36,47.55 47.15,48.76 47.15,57.75 47.95,58.56 47.95,59.86 48.33,60.23 48.33,61.69 48.73,62.09 48.73,63.55 48.77,63.58 CUT18.P$2
3_6_CAT  (via drill 0.5)
  Top 0.203: N3.6(CAT) 63.9,33.99 62.92,33.01 62.11,33.01 61.54,33.58 59.4,33.58 58.43,34.55 49.2,34.55 v48.26,33.61
  Bottom 0.203: v48.26,33.61 48.26,34.06 47.1,35.23 47.1,38.61 47.95,39.47 47.95,47.38 46.74,48.59 46.74,57.92 47.54,58.72 47.54,60.01 47.92,60.4 47.92,61.86 48.33,62.26 48.33,65.18 CUT15.P$1
  Bottom 0.305: N3.6(CAT) 65.48,30.85 65.8,30.54 65.8,24.22 65.53,23.96 BR11.P$2
3_7_GRID  (via drill 0.5)
  Top 0.203: N3.7(GRID) 61.28,35.37 60.3,36.35 59.49,36.35 58.92,35.77 50.73,35.77 49.59,36.91 48.52,36.91 v48.26,37.17 | v68.58,13.29 v68.58,17.86 | v68.58,23.96 68.58,29.61 v68.11,30.09
  Bottom 0.203: v48.26,37.17 48.26,38.18 48.77,38.69 48.77,47.71 47.55,48.93 47.55,57.58 48.36,58.39 48.36,59.69 48.73,60.06 48.73,61.52 48.77,61.55 CUT14.P$1 | N3.7(GRID) v68.11,30.09 67.56,29.55 BR13.P$1 | R53.2 R54.2 R60.2 R59.2 R58.2 R57.2 R56.2 R55.2 68.24,12.95 v68.58,13.29 | v68.58,17.86 v68.58,23.96
3_8_C  (via drill 0.5)
  Top 0.203: N3.8(C) 70.99,37.8 71.63,37.17 71.63,25.48 v71.12,24.98
  Bottom 0.203: SV9.6 65.27,60.24 66.34,59.17 66.34,57.21 67.97,55.57 67.97,48.58 68.99,47.56 68.99,45.51 69.6,44.9 69.67,44.9 71.12,43.45 71.12,40.34 69.79,39.01 N3.8(C) | v71.12,24.98 71.12,24.52 69.96,23.36 69.96,17.78 68.55,16.37 63.02,16.37 61.98,15.32 R57.1
3_9_DP  (via drill 0.5)
  Top 0.203: N3.9(DP) 70.59,40.75 72.14,39.2 72.14,24.47 v71.12,23.45
  Bottom 0.203: SV9.8 65.27,57.7 67.54,55.43 67.54,50.91 67.56,50.88 67.56,48.41 68.58,47.4 68.58,45.3 69.38,44.49 69.5,44.49 70.07,43.92 70.07,40.82 N3.9(DP) | v71.12,23.45 71.12,22.49 70.36,21.73 70.36,17.61 68.58,15.83 65.19,15.83 R56.1
3_A_A  (via drill 0.5)
  Top 0.254: v64.01,50.38 50.8,50.38 v50.29,50.88 | v52.32,30.06 53.14,30.06 53.7,30.62 60.6,30.62 61.16,30.06 v64.01,30.06
  Bottom 0.254: N3.A(A) 64,50.37 v64.01,50.38 | CUT13.P$1 49.78,54.44 50.29,53.93 v50.29,50.88 52.32,48.85 v52.32,30.06 51.82,29.55 R53.1 | BR14.P$1 v64.01,30.06
3_LDP_G  (via drill 0.5)
  Top 0.203: v54.36,29.04 v59.94,29.04
  Bottom 0.203: R54.1 53.85,28.53 v54.36,29.04 | BR15.P$2 60.45,28.53 v59.94,29.04 58.93,29.04 58.32,29.65 58.32,35.98 58.76,36.42 58.79,36.42 60.29,37.92 60.29,43.77 60.45,43.77 61.12,44.44 N3.LHDP(G)
3_RDP_NC  (via drill 0.5)
  Top 0.203: v66.04,49.87 65.7,49.87 64.65,48.82 50.16,48.82 49.62,49.36 v48.77,49.36
  Bottom 0.203: N3.RHDP(NC) 66.88,47.95 66.73,48.1 66.73,49.18 v66.04,49.87 | v48.77,49.36 48.77,50.21 48.37,50.61 48.37,57.25 49.62,58.5 CUT16.P$2
4_0_B  (via drill 0.5)
  Top 0.203: v95,43.26 91.35,43.26 N4.0(B)
  Bottom 0.203: SV10.10 87.66,56.19 90.93,52.92 90.93,43.68 N4.0(B) | R63.1 98.04,19.9 96.83,21.12 96.83,41.44 v95,43.26
4_1_F  (via drill 0.5)
  Top 0.203: N4.1(F) 80.65,43.26 77.22,43.26 76.71,42.76 76.71,34.7 79.65,31.75 79.65,23.35 v79.25,22.94
  Bottom 0.203: SV10.9 84.73,55.16 83.66,54.09 83.66,49.2 81.79,47.33 81.79,44.4 N4.1(F) | v79.25,22.94 80.01,22.18 80.01,22.12 80.46,21.68 80.95,21.68 82.43,20.2 82.43,19.25 86.23,15.45 87.75,15.45 87.88,15.32 R68.1
4_2_E  (via drill 0.5)
  Top 0.203: v80.77,22.44 80.77,22.94 80.26,23.45 80.26,31.71 77.11,34.86 77.11,40.11 77.72,40.72 79.83,40.72 N4.2(E)
  Bottom 0.203: SV10.7 84.73,57.7 83.26,56.23 83.26,49.37 81.28,47.4 81.28,45.27 79.93,43.92 79.93,40.82 N4.2(E) | R67.1 89.36,14.65 88.15,15.86 86.4,15.86 82.84,19.42 82.84,20.37 v80.77,22.44
4_3_D  (via drill 0.5)
  Top 0.203: v81.79,23.45 80.77,24.47 80.77,31.78 77.57,34.98 77.57,37.01 78.23,37.68 80.08,37.68 N4.3(D)
  Bottom 0.203: SV10.5 84.73,60.24 82.85,58.36 82.85,51.95 82.8,51.9 82.8,49.49 80.87,47.56 80.87,45.44 78.88,43.45 78.88,40.34 80.21,39.01 N4.3(D) | R66.1 91.4,14.65 89.78,16.27 86.57,16.27 83.24,19.59 83.24,20.54 81.82,21.96 81.82,23.42 v81.79,23.45
4_4_CAT  (via drill 0.5)
  Top 0.203: N4.4(CAT) 88.11,35.37 89.41,36.66 98.04,36.66 v99.06,37.68
  Bottom 0.203: v99.06,37.68 99.06,38.69 98.55,39.2 98.55,42.12 102.01,45.58 102.01,59.69 101.12,60.57 101.12,62.03 100.58,62.57 CUT23.P$2
  Bottom 0.305: N4.4(CAT) 81.89,34.01 84.72,31.19 84.72,27.84 84.73,27.77 84.76,27.63 84.75,27.61 84.76,27.45 84.76,26.56 84.75,26.41 84.76,26.38 84.76,25.05 85.34,24.47 BR19.P$1
4_5_NC  (via drill 0.5)
  Top 0.203: N4.5(NC) 86.1,33.99 87.08,33.01 87.89,33.01 88.46,33.58 99.6,33.58 v100.08,33.1
  Bottom 0.203: v100.08,33.1 100.08,33.56 100.83,34.31 100.83,34.94 100.58,35.19 100.58,38.32 99.5,39.4 99.5,41.92 102.82,45.24 102.82,60.02 102.07,60.77 102.07,65.14 100.58,66.63 CUT24.P$2
4_6_CAT  (via drill 0.5)
  Top 0.203: N4.6(CAT) 99.44,33.99 v100.08,34.63
  Bottom 0.203: v100.08,34.63 100.08,38.25 99.09,39.23 99.09,42.09 102.41,45.41 102.41,59.86 101.67,60.6 101.67,63.52 100.58,64.6 CUT21.P$1
  Bottom 0.305: N4.6(CAT) 87.48,29.74 88.66,28.56 88.66,24.01 88.9,23.77 BR20.P$2
4_7_GRID  (via drill 0.5)
  Top 0.203: v98.04,35.14 90.33,35.14 N4.7(GRID)
  Bottom 0.203: R61.2 R62.2 R68.2 R67.2 R66.2 R65.2 R64.2 R63.2 98.04,13.17 98.9,14.02 98.9,19.62 97.23,21.28 97.23,34.32 v98.04,35.14 98.04,42.19 101.53,45.68 101.53,50.81 101.6,50.88 101.6,59.52 100.58,60.54 CUT20.P$1 | N4.7(GRID) 90.11,29.87 90.42,29.55 BR16.P$1
4_8_C
  Bottom 0.203: SV10.6 87.27,60.24 88.74,58.77 88.74,56.25 91.85,53.15 91.85,44.72 93.12,43.45 93.12,39.14 N4.8(C) 96.01,33.58 96.01,20.91 93.98,18.88 R65.1
4_9_DP  (via drill 0.5)
  Top 0.203: v95,40.72 92.17,40.72 N4.9(DP)
  Bottom 0.203: SV10.8 87.27,57.7 88.34,56.63 88.34,56.09 91.44,52.98 91.44,44.55 92.07,43.92 92.07,40.82 N4.9(DP) | R64.1 96.01,20.34 96.42,20.74 96.42,39.3 v95,40.72
4_A_A  (via drill 0.5)
  Top 0.254: N4.A(A) 87.04,46.19 88.13,47.28 99.52,47.28 v99.57,47.33 99.87,47.33 99.93,47.38 101.24,47.38 102.16,46.46 102.16,32.96 100.73,31.52 99.42,31.52 99.36,31.58 v94.49,31.58 | v82.8,15.83 90.93,15.83 v92.46,17.36
  Bottom 0.254: CUT19.P$1 v99.57,47.33 | BR17.P$1 86,28.64 N4.A(A) | R61.1 83.82,14.82 v82.8,15.83 | v92.46,17.36 92.46,19.9 94.78,22.22 94.78,31.28 v94.49,31.58
4_LDP_G  (via drill 0.5)
  Top 0.203: N4.LHDP(G) 82.94,45.3 77.72,45.3 76.2,43.77 76.2,34.63 79.25,31.58 79.25,24.02 78.49,23.26 78.49,22.63 79.25,21.87 v79.25,20.91 80.01,21.68 81.09,21.68 82.55,23.14 82.55,23.77 82.1,24.21 82.05,24.21 81.28,24.98 81.28,28.53 v82.3,29.55
  Bottom 0.203: R62.1 85.85,15.26 82.03,19.09 82.03,19.9 80.26,19.9 v79.25,20.91 | BR18.P$2 83.31,28.53 v82.3,29.55
4_RDP_NC  (via drill 0.5)
  Top 0.203: N4.RHDP(NC) 100.26,45.48 v100.58,45.8
  Bottom 0.203: v100.58,45.8 100.58,46.15 101.12,46.68 101.12,57.25 101.09,57.28 101.09,57.49 100.08,58.5 CUT22.P$2
5_0_B  (via drill 0.5)
  Top 0.203: N5.0(B) 121.16,43.52 v121.41,43.77
  Bottom 0.203: SV11.10 115.6,56.19 119.38,52.41 119.38,43.8 N5.0(B) | v121.41,43.77 121.41,41.44 121.53,41.32 121.53,21.54 117.35,17.36 115.32,17.36 113.79,15.83 R71.1
5_1_F  (via drill 0.5)
  Top 0.203: v106.17,37.17 106.17,38.13 105.92,38.38 105.92,40.53 N5.1(F)
  Bottom 0.203: SV11.9 112.49,56.19 109.22,52.92 109.22,43.83 N5.1(F) | R76.1 107.7,19.76 107.4,20.06 107.4,35.94 v106.17,37.17
5_2_E  (via drill 0.5)
  Top 0.203: v106.68,38.69 106.68,39.57 N5.2(E)
  Bottom 0.203: SV11.7 112.73,57.7 111.66,56.63 111.66,55.93 108.81,53.08 108.81,53.02 108.71,52.92 108.71,44.71 107.93,43.92 107.93,40.82 N5.2(E) | R75.1 109.73,18.3 107.81,20.23 107.81,36.83 107.23,37.4 107.23,38.14 v106.68,38.69
5_3_D
  Bottom 0.203: SV11.5 112.73,60.24 111.26,58.77 111.26,56.1 108.31,53.15 108.31,44.88 106.88,43.45 106.88,40.34 108.21,39.01 N5.3(D) 108.21,20.4 111.76,16.85 R74.1
5_4_CAT  (via drill 0.5)
  Top 0.203: N5.4(CAT) 116.72,35.37 117.7,36.35 123.58,36.35 124.15,36.91 124.2,36.91 v124.97,37.68
  Bottom 0.203: CUT29.P$2 125.48,62.57 126.39,61.65 126.39,58.74 127.2,57.93 127.2,54.29 124.97,52.06 v124.97,37.68
  Bottom 0.305: N5.4(CAT) 109.89,31.92 112.78,29.04 112.78,28.83 112.51,28.56 112.51,26.98 112.78,26.71 BR21.P$1
5_5_NC  (via drill 0.5)
  Top 0.203: N5.5(NC) 114.1,33.99 115.08,33.01 115.89,33.01 116.46,33.58 123.47,33.58 v124.46,32.6
  Bottom 0.203: v124.46,32.6 124.46,33.05 125.22,33.81 125.22,35.26 126.64,36.69 126.64,39.69 125.88,40.45 125.88,51.83 128.01,53.96 128.01,58.27 127.2,59.08 127.2,65.92 126.49,66.63 CUT30.P$2
5_6_CAT  (via drill 0.5)
  Top 0.203: N5.6(CAT) 118.74,33.99 119.38,34.63 123.95,34.63 v124.46,34.12
  Bottom 0.203: v124.46,34.12 124.46,35.08 126.23,36.85 126.23,39.52 125.48,40.28 125.48,51.99 127.61,54.12 127.61,58.1 126.8,58.91 126.8,63.79 125.98,64.6 CUT27.P$1
  Bottom 0.305: N5.6(CAT) 115.48,31.15 116.09,30.54 116.09,24.52 116.33,24.27 BR22.P$2
5_7_GRID  (via drill 0.5)
  Top 0.203: N5.7(GRID) 123.67,35.37 v124.46,36.15 | v123.95,29.04 v119.38,29.04
  Bottom 0.203: CUT26.P$1 125.48,60.54 125.98,60.03 125.98,58.57 126.79,57.76 126.79,54.46 124.46,52.13 124.46,38.24 124.21,37.99 124.21,37.36 124.46,37.11 v124.46,36.15 122.94,34.63 122.94,30.56 122.75,30.38 122.75,29.55 | R69.2 R70.2 R76.2 R75.2 R74.2 | 111.59,12.78 R74.2 | 113.63,12.78 R71.2 | 115.66,12.78 R72.2 | 122.75,29.55 122.75,18.06 117.86,13.17 R73.2 R72.2 | 122.75,29.55 123.44,29.55 v123.95,29.04 | BR23.P$1 118.11,27.77 v119.38,29.04 | R74.2 R71.2 | R71.2 R72.2
5_8_C  (via drill 0.5)
  Top 0.203: 120.17,38.18 N5.8(C) 119.79,38.08 v122.94,41.23
  Bottom 0.203: SV11.6 115.27,60.24 116.74,58.77 116.74,56.19 120.48,52.46 120.48,41.8 121.12,41.15 121.12,39.14 N5.8(C) | R73.1 117.86,16.72 122.34,21.2 122.34,37.59 122.43,37.68 122.43,39.71 122.94,40.22 v122.94,41.23
5_9_DP  (via drill 0.5)
  Top 0.203: v122.43,42.25 121.65,42.25 N5.9(DP)
  Bottom 0.203: SV11.8 115.27,57.7 116.34,56.63 116.34,56.03 119.79,52.58 119.79,44.89 119.89,44.79 119.89,44.11 120.07,43.92 120.07,40.82 N5.9(DP) | R72.1 115.82,15.26 121.94,21.37 121.94,41.76 v122.43,42.25
5_A_A  (via drill 0.5)
  Top 0.254: 114.3,46.19 N5.A(A) | 114.3,46.19 115.04,46.19 116.13,47.28 122.38,47.28 v122.43,47.33 | v106.68,46.82 109.92,46.82 110.38,47.28 113.21,47.28 114.3,46.19 | v105.16,28.53 112.78,28.53 v114.3,30.06
  Bottom 0.254: v122.43,47.33 122.43,52.41 124.97,54.95 CUT25.P$1 | R69.1 103.63,25.28 104.2,25.84 104.2,27.16 103.72,27.63 103.72,28.02 | v106.68,46.82 105.9,46.04 105.9,44.24 103.72,42.06 103.72,28.02 | 103.72,28.02 104.65,28.02 v105.16,28.53 | BR24.P$1 v114.3,30.06
5_LDP_G  (via drill 0.5)
  Top 0.203: v105.66,35.64 105.66,36.6 105.41,36.85 105.41,42.51 108.2,45.3 110.94,45.3 N5.LHDP(G) | v110.24,30.06 106.17,30.06 v105.66,30.56
  Bottom 0.203: R70.1 105.66,19.39 106.99,20.72 106.99,30.56 | 106.99,30.56 106.99,34.31 v105.66,35.64 | BR25.P$2 110.74,29.55 v110.24,30.06 | v105.66,30.56 106.99,30.56
5_RDP_NC  (via drill 0.5)
  Top 0.203: N5.RHDP(NC) 122.75,45.48 v122.94,45.3
  Bottom 0.203: v122.94,45.3 122.94,45.64 123.98,46.68 123.98,52.23 126.39,54.63 126.39,57.25 125.98,57.65 125.98,58 125.48,58.5 CUT28.P$2
6_0_B
  Bottom 0.203: SV12.10 137.95,56.19 141.22,52.92 141.22,43.65 N6.0(B) 140.21,42.63 140.21,37.17 141.73,35.64 141.73,21.42 135.77,15.45 134.96,15.45 134.16,14.65 R79.1
6_1_F  (via drill 0.5)
  Top 0.203: v129.03,44.79 129.63,44.79 N6.1(F)
  Bottom 0.203: SV12.9 134.73,56.07 131.06,52.41 131.06,43.67 N6.1(F) | R84.1 127.51,19.9 129.03,21.42 129.03,34.06 128.27,34.82 128.27,43.42 129.03,44.18 v129.03,44.79
6_2_E  (via drill 0.5)
  Top 0.203: v129.03,35.14 129.03,39.92 N6.2(E)
  Bottom 0.203: SV12.7 134.73,57.7 133.66,56.63 133.66,55.58 130.66,52.58 130.66,51.49 130.56,51.39 130.56,45.8 130.66,45.7 130.66,44.65 129.93,43.92 129.93,40.82 N6.2(E) | R83.1 129.54,26.5 129.64,26.6 129.64,34.53 v129.03,35.14
6_3_D
  Bottom 0.203: SV12.5 134.73,60.24 133.26,58.77 133.26,55.75 130.15,52.64 130.15,44.72 128.88,43.45 128.88,39.14 N6.3(D) 130.05,37.64 130.05,24.47 131.57,22.94 R82.1
6_4_CAT  (via drill 0.5)
  Top 0.203: v145.29,38.18 143.45,36.35 139.7,36.35 137.86,38.18 v134.62,38.18
  Bottom 0.203: CUT35.P$2 145.8,62.57 147.01,61.35 147.01,48.24 146.81,48.04 146.81,39.71 v145.29,38.18 | N6.4(CAT) 131.9,35.97 134.11,38.18 v134.62,38.18
  Bottom 0.305: N6.4(CAT) 131.9,32.4 133.04,31.25 133.04,30.62 134.03,29.63 134.03,27.66 134.04,27.63 134.03,27.62 134.04,27.55 134.04,26.47 134.03,26.4 134.04,26.38 134.04,25.56 134.62,24.98 BR26.P$1
6_5_NC  (via drill 0.5)
  Top 0.203: N6.5(NC) 136.1,33.99 137.08,33.01 145.25,33.01 145.34,33.1 v146.3,33.1
  Bottom 0.203: CUT36.P$2 146.3,66.63 147.82,65.11 147.82,47.91 147.62,47.71 147.62,39.37 146.81,38.56 146.81,35.19 147.06,34.94 147.06,34.31 146.3,33.56 v146.3,33.1
6_6_CAT  (via drill 0.5)
  Top 0.203: N6.6(CAT) 140.59,33.99 141.22,34.63 v146.3,34.63
  Bottom 0.203: 146.3,35.08 v146.3,34.63 146.3,38.62 147.22,39.54 147.22,47.88 147.42,48.08 147.42,63.49 146.3,64.6 CUT33.P$1
  Bottom 0.305: N6.6(CAT) 137.48,29.02 137.93,28.56 137.93,24.52 138.18,24.27 BR27.P$2
6_7_GRID  (via drill 0.5)
  Top 0.203: N6.7(GRID) 145.01,35.37 v145.29,35.64
  Bottom 0.203: R77.2 R78.2 R84.2 R83.2 R82.2 | R82.2 131.74,12.95 132.08,13.29 131.91,13.29 R82.2 | R82.2 R79.2 R80.2 R81.2 139.36,12.95 146.3,19.9 146.3,32.03 145.55,32.79 145.55,35.39 v145.29,35.64 | CUT32.P$1 145.8,60.54 146.61,59.73 146.61,48.41 146.3,48.11 146.41,48.01 146.41,40.22 145.13,38.94 144.97,38.94 144.53,38.5 144.53,37.87 145.29,37.11 v145.29,35.64 | v145.29,35.64 145.8,35.64 | BR28.P$1 139.7,31.58 140.21,32.09 140.21,35.26 N6.7(GRID)
6_8_C
  Bottom 0.203: SV12.6 137.27,60.24 138.74,58.77 138.74,56.55 142.14,53.15 142.14,51.49 142.24,51.39 142.24,44.33 143.12,43.45 143.12,39.14 N6.8(C) 141.79,36.99 142.65,36.14 142.65,21.19 137.74,16.27 137.74,14.72 R81.1
6_9_DP
  Bottom 0.203: SV12.8 137.27,57.7 138.34,56.63 138.34,56.38 141.63,53.08 141.63,52.51 141.73,52.41 141.73,44.26 142.07,43.92 142.07,40.82 | 142.07,40.82 N6.9(DP) | R80.1 135.64,14.75 142.14,21.25 142.14,25.38 142.24,25.48 142.24,35.71 141.76,36.19 141.76,36.44 140.81,37.4 140.81,40.12 140.72,40.22 141.22,40.72 141.98,40.72 142.07,40.82
6_A_A  (via drill 0.5)
  Top 0.254: v143.76,48.34 142.7,47.28 138.13,47.28 137.04,46.19 N6.A(A) 134.3,47.89 128.38,47.89 128.32,47.84 127.51,47.84 127,47.33 127,39.65 127.8,38.85 127.8,36.5 127.29,35.99 127.29,29.55 | v127,25.48 127,26.76 127.29,27.05 127.29,29.55 | v135.64,29.55 127.29,29.55
  Bottom 0.254: 144.84,53.93 144.84,53.28 143.76,52.2 v143.76,48.34 | 144.84,53.93 144.84,54.44 | CUT31.P$1 144.78,53.99 144.84,53.93 | R77.1 123.44,17.02 123.98,17.55 123.98,19.41 127.26,22.7 127.26,25.22 v127,25.48 | BR29.P$1 136.14,29.04 v135.64,29.55
6_LDP_G  (via drill 0.5)
  Top 0.203: v129.03,46.31 132.29,46.31 N6.LHDP(G) 132.87,45.23 132.87,34.96 132.08,34.17 v132.08,31.07
  Bottom 0.203: R78.1 125.48,18.44 128.49,21.45 128.49,34.03 127.87,34.65 127.87,45.15 v129.03,46.31 | v132.08,31.07 132.59,30.56 BR30.P$2
6_RDP_NC  (via drill 0.5)
  Top 0.203: N6.RHDP(NC) 143.44,45.48 v143.76,45.8
  Bottom 0.203: v143.76,45.8 143.76,46.15 146.2,48.58 146.2,58.1 145.8,58.5 CUT34.P$2
+3V3  (via drill 0.5)
  Top 0.508: 83.57,102.52 U1.VCC 83.3,103.04 C17.1 | C17.1 C18.1 84.84,108.45 82.8,110.48 | 82.8,110.48 82.8,113.24 L1.P$2 | U2.8 108.14,111.38 C7.1 108.42,112.62 107.75,113.3 | 82.8,110.48 82.55,110.48 81.79,109.72 v61.47,109.72 | R27.1 63.16,86.1 62.23,86.1 61.47,85.33 v61.47,85.59 59.94,87.11 R13.1 R8.1 | R11.2 R12.2 86.77,104.23 86.36,104.64 86.36,106.1 C17.1 | L1.P$2 89.63,113.75 91.95,116.07 99.57,116.07 | R32.1 99.57,116.07 | 99.57,116.07 102.75,116.07 P2.P$1 105.1,113.71 105.1,113.57 105.37,113.3 107.75,113.3 | 107.75,113.3 108.01,113.57 108.01,114.35 111.25,117.59 112.61,117.59 C6.+ C5.+ 132.5,118.01 133.6,119.12 134.79,119.12 R7.2 R28.2 R29.2 R30.2 135.88,126.52 136.94,126.52 137.67,127.24 141.73,127.24 142.52,128.03 143.26,128.03 145.24,130.01 145.24,130.44 145.95,131.15 145.95,132.9 J3.1 | L1.P$2 79.87,113.75 79.12,113 77.7,113 v77.22,112.51
  Bottom 0.508: v61.47,109.72 v61.47,85.59 | v77.22,112.51 77.22,119.12 74.68,121.66 74.68,144.86 J6.2
BUTTON1  (via drill 0.5)
  Top 0.203: S3.2 67.74,156.53 69.09,155.18 69.09,151.63 69.6,151.12 | 69.6,151.12 70.08,150.64 129.51,150.64 133.1,147.06 133.93,147.06 134.29,147.42 137.81,147.42 v141.22,144.01 | R7.1 136.65,119.12 v141.73,119.12 142.24,119.12 143.76,120.64 143.76,121.53 145.34,123.1 145.34,123.69 146.1,124.46 J3.5 | 69.6,151.12 v70.1,151.63 | v69.6,92.19 66.96,92.19 U1.GPIO5
  Bottom 0.203: v141.22,144.01 141.22,136.39 141.73,135.88 v141.73,119.12 | 70.2,131.72 70.51,132.03 | 70.2,131.72 66.59,128.11 55.37,128.11 51.46,124.2 51.46,115.47 55.91,111.02 62.45,111.02 68.07,105.4 68.07,93.72 v69.6,92.19 | v70.1,151.63 70.1,150.1 68.99,148.99 68.99,147.41 69.24,147.16 69.24,139.86 70.51,138.59 70.51,132.03 | 70.51,132.03 70.2,131.72
BUTTON2  (via drill 0.5)
  Top 0.203: R8.2 58,95.07 59.69,96.76 64.52,96.76 65.02,97.27 65.02,97.53 65.53,98.03 66.68,98.03 U1.GPIO2 67.37,97.78 v69.6,97.78 | 147.6,127.07 J3.4 145.35,127 144.58,126.23 144.58,125.03 144.93,124.68 144.93,123.27 143.57,121.91 143.51,121.91 v142.75,121.15 136.62,121.15 R28.1 | S4.2 77.74,157.2 79.25,155.69 79.25,151.63 79.76,151.12 129.61,151.12 133.13,147.6 133.89,147.6 134.12,147.82 138.48,147.82 141.98,144.32 141.98,143.25 v142.24,142.99
  Bottom 0.203: v142.24,142.99 142.24,121.66 v142.75,121.15 | S4.2 77.74,156.19 78.74,155.18 78.74,154.17 76.2,151.63 73.66,151.63 69.6,147.56 69.6,147.37 69.64,147.33 69.64,140.03 | 69.64,140.03 70.42,139.25 70.42,149.85 70.86,150.29 | 70.86,151.94 70.42,152.39 | 70.42,152.39 69.79,152.39 | 58.81,156.8 58.81,157.69 | 58.81,157.69 58.18,158.31 | 58.18,158.31 57.3,158.31 | 57.3,158.31 56.67,157.69 | 56.67,157.69 56.67,156.8 | 66.34,146.79 65.71,147.42 | 65.71,147.42 64.83,147.42 | 64.83,147.42 64.2,146.79 | 64.2,146.79 64.83,147.42 | 64.83,147.42 65.71,147.42 | 65.71,147.42 66.34,146.79 | 56.67,156.8 56.67,157.69 | 56.67,157.69 57.3,158.31 | 57.3,158.31 58.18,158.31 | 58.18,158.31 58.81,157.69 | 58.81,157.69 58.81,156.8 | 69.79,152.39 70.42,152.39 | 70.42,152.39 70.86,151.94 | 69.64,140.03 70.92,138.76 70.92,131.86 66.76,127.7 55.54,127.7 51.87,124.03 51.87,115.64 55.95,111.56 62.48,111.56 68.48,105.57 68.48,98.9 v69.6,97.78 | 68.03,150.59 68.03,147.71 | 68.03,147.71 68.03,150.59 | 70.86,151.25 70.86,151.94 | 56.67,156.8 62.03,151.45 | 62.03,151.45 56.67,156.8 | 70.86,151.94 70.86,151.25 | 70.86,150.29 70.86,151.25 | 62.03,151.45 62.89,150.59 | 62.89,150.59 68.03,150.59 | 68.03,150.59 62.89,150.59 | 62.89,150.59 62.03,151.45 | 70.86,151.25 70.86,150.29 | 70.86,150.29 69.64,149.07 69.64,140.03 | 69.79,152.39 63.22,152.39 | 63.22,152.39 58.81,156.8 | 58.81,156.8 63.22,152.39 | 63.22,152.39 69.79,152.39 | 64.2,146.79 64.2,136.1 62.82,134.72 61.66,134.72 61.66,135.12 63.17,135.12 64.2,136.16 64.2,146.79 | 66.34,146.79 66.34,146.46 66.78,146.46 68.03,147.71 | 66.34,146.79 66.73,146.4 68.03,147.71
BUTTON3  (via drill 0.5)
  Top 0.203: 147.56,129.43 J3.3 147.38,129.24 145.83,129.24 144.17,127.58 144.17,124.86 144.52,124.51 144.52,123.88 144.08,123.44 144.02,123.44 v143.26,122.67 138.68,122.67 138.18,123.18 136.75,123.18 R29.1 | S5.2 87.86,157.25 89.41,155.69 89.41,152.14 90.02,151.53 129.78,151.53 133.3,148 133.73,148 133.95,148.23 138.65,148.23 143,143.88 143,142.23 v143.26,141.98 | U1.GPIO12 85.81,98.25 v85.85,98.29 | v102.62,108.96 104.71,108.96 104.84,108.83 U2.6 106.95,108.84 107.54,108.25 110.54,108.25 117.35,115.05 122.43,115.05 122.94,115.56 123.84,115.56 123.85,115.56 140.21,115.56 v141.73,117.08
  Bottom 0.203: v143.26,141.98 143.26,140.96 142.75,140.45 142.75,123.18 v143.26,122.67 143.76,122.16 143.76,119.12 v141.73,117.08 | v85.85,98.29 85.85,98.39 86.87,99.41 93.13,99.41 95.54,101.81 98.08,101.81 102.36,106.09 102.36,108.7 v102.62,108.96
BUTTON4  (via drill 0.5)
  Top 0.203: S6.2 98.02,157.25 99.06,156.2 99.06,152.64 99.77,151.93 129.94,151.93 133.2,148.68 138.77,148.68 144.01,143.44 144.01,141.22 v144.27,140.96 | R30.1 136.78,125.72 137.67,125.72 139.19,124.2 v143.76,124.2 143.76,127.75 145.8,129.78 145.8,130.2 146.18,130.59 | 146.18,130.59 | 146.18,130.59 146.51,130.92 | 146.51,130.92 | 146.51,130.92 J3.2 | U1.GPIO13 85.41,100.25 v85.85,99.81 | v101.6,106.42 101.6,106.92 102.11,107.43 104.71,107.43 U2.5 107.33,107.57 107.6,107.84 110.71,107.84 117.52,114.65 122.6,114.65 123.1,115.15 123.68,115.15 141.32,115.15 v141.73,115.56
  Bottom 0.203: v144.27,140.96 143.83,140.96 143.15,140.28 143.15,124.81 v143.76,124.2 143.76,123.24 144.17,122.83 144.17,118.95 142.49,117.27 142.49,116.77 141.73,116.01 v141.73,115.56 | v85.85,99.81 92.96,99.81 95.5,102.35 98.04,102.35 101.6,105.91 v101.6,106.42
DATA_CLK
  Top 0.203: R5.1 68.7,105.78 69.07,106.16 70.53,106.16 70.7,105.98 70.7,102 72.26,100.45 78.74,100.45 80.39,98.8 80.39,97.14 81.28,96.26 U1.GPIO14 | U1.GPIO14
DATA_IN
  Top 0.203: R4.1 62.4,103.16 68.53,103.16 68.89,102.79 68.89,102.72 71.4,100.22 71.58,100.04 78.49,100.04 79.98,98.54 79.98,96.98 80.93,96.03 80.93,94.7 81.28,94.35 83.2,94.35 U1.GPIO16
GND  (via drill 0.5, 4 pad 6.45)  (1 unrouted)
  Top 0.203: C15.2 93.03,112.07 93.22,112.26
  other vias: 142,88 142,152 8,152 8,88 142,72 142,8 8,8 8,72 21.08,106.16 25.4,105.78 44.32,107.43 51.94,101.84 100.2,106.54 64.14,102.1 54.86,121.78 36.96,109.46 44.2,103.11 32.64,107.05 59.05,98.29 90.42,112.26 75.95,101.59 74.68,97.65 74.68,89.02 80.39,92.83 113.54,86.22 96.52,134.36 115.82,128.26 130.56,128.39 136.91,128.01 137.03,113.02 126.24,134.61 129.03,134.23 145.03,135.88 128.4,102.73 127.64,85.97 135.76,83.94 88.14,83.3 57.15,85.46 50.8,87.37 37.59,92.57 17.14,97.27 14.61,90.41 7.37,94.86 7.75,102.99 4.19,114.29 3.56,118.73 8.64,139.44 19.43,140.58 21.21,143.88 24.89,137.4 41.27,138.93 44.2,140.96 58.55,139.44 57.66,145.66 68.07,146.68 76.2,147.18 73.25,141.44 80.52,146.93 90.68,146.29 104.9,139.94 108.58,140.58 118.49,142.61 81.79,119.37 64.01,125.59 61.59,115.69 55.88,124.32 56.01,126.86 64.14,111.75 58.17,109.97 80.39,101.34 69.98,88.51 49.53,84.44 51.69,98.67 14.22,122.8 4.57,130.55 28.19,132.45 32.77,132.32 110.24,134.23 135.25,90.8 108.08,83.3 104.52,102.22 99.19,100.19 91.06,96.64 82.3,105.27 66.42,104.64 70.1,95.88 119.13,85.59 86.11,96.64 69.6,99.56 52.58,111.5 93.85,107.81 93.34,114.04 99.57,113.53 55.12,116.19 13.21,19.77 10.16,21.8 76.3,139.91 11.68,121.28 95.25,125.72 134.37,41.49 137.92,41.99 144.53,43.01 144.53,25.23 139.45,15.58 133.35,16.59 132.84,24.21 140.46,22.69 124.21,23.71 118.62,21.17 112.52,17.61 109.98,23.71 105.92,24.21 105.41,22.18 100.84,17.61 100.84,21.17 92.2,23.71 83.57,24.21 87.12,18.12 80.52,17.61 77.47,25.74 72.39,17.1 72.39,11.01 77.98,11.01 61.21,17.1 59.18,23.71 55.12,22.18 49.53,23.71 46.99,17.61 40.89,21.67 35.81,17.61 32.77,24.21 27.18,21.17 26.67,18.12 19.05,21.17 2.29,25.74 7.37,16.09 16,43.01 12.45,37.93 4.19,33.36 6.86,48.09 11.94,48.09 17.02,48.6 7.37,53.68 21.08,55.71 24.13,44.03 26.67,47.58 33.78,39.96 38.35,50.63 33.78,48.6 43.43,50.63 44.45,45.55 17.02,68.92 39.88,68.92 44.45,56.22 39.88,64.35 46.48,66.38 52.07,53.68 56.64,52.66 55.63,46.57 59.18,58.25 57.15,63.84 59.18,68.41 67.82,58.25 72.9,52.15 71.37,45.55 65.28,43.01 62.23,37.42 80.01,50.12 80.52,63.33 90.68,61.3 93.73,66.38 93.73,59.27 88.65,51.14 83.06,43.52 83.06,39.45 87.63,38.44 87.63,42.5 94.74,38.44 97.28,44.03 94.74,51.65 91.69,30.82 99.31,29.29 105.41,33.36 106.93,50.63 108.97,60.79 119.63,67.39 119.13,60.79 130.81,67.39 128.27,50.63 134.37,50.12 139.45,50.63 146.56,68.41 147.57,28.79 120.65,14.05 115.06,42.5 113.03,38.44 109.6,113.91 103.5,112.89 106.81,109.97 6.86,45.55
  pour Top (isolate 0.305, rank 2): 0,80 0,160 150,160 150,80
  pour Bottom (isolate 0.305, rank 2): 0,80 0,160 150,160 150,80
  pour Bottom (isolate 0.305, rank 2): 0,0 150,0 150,80 0,80
  pour Top (isolate 0.305, rank 2): 0,80 0,0 150,0 150,80
HV_DATA_CLK  (via drill 0.5)
  Top 0.203: U$1.28 23,106.3 v21.08,104.13 | v21.08,84.57 21.08,83.87 21.33,83.62 21.33,83.31 21.54,83.1 51.1,83.1 v51.56,83.56 | 55.18,108.7 55.53,108.35 83.41,108.35 v83.57,108.19 | v123.19,106.16 123.82,106.79 123.82,109.92 122.34,111.39 116.67,111.39 110.86,105.58 92.53,105.58 91.19,106.92 90.68,106.92 v90.42,107.18 | v127,106.16 U$2.28 | 55.18,108.7 54.04,108.7 53.66,108.32 v53.09,108.32 R6.2 | U$3.3 55.31,100.89 v55.37,100.95 | v55.12,109.59 55.12,108.76 55.18,108.7